# EAGLE design v3leg (EAGLE 7.7.0)

## Sheet 1 of 5
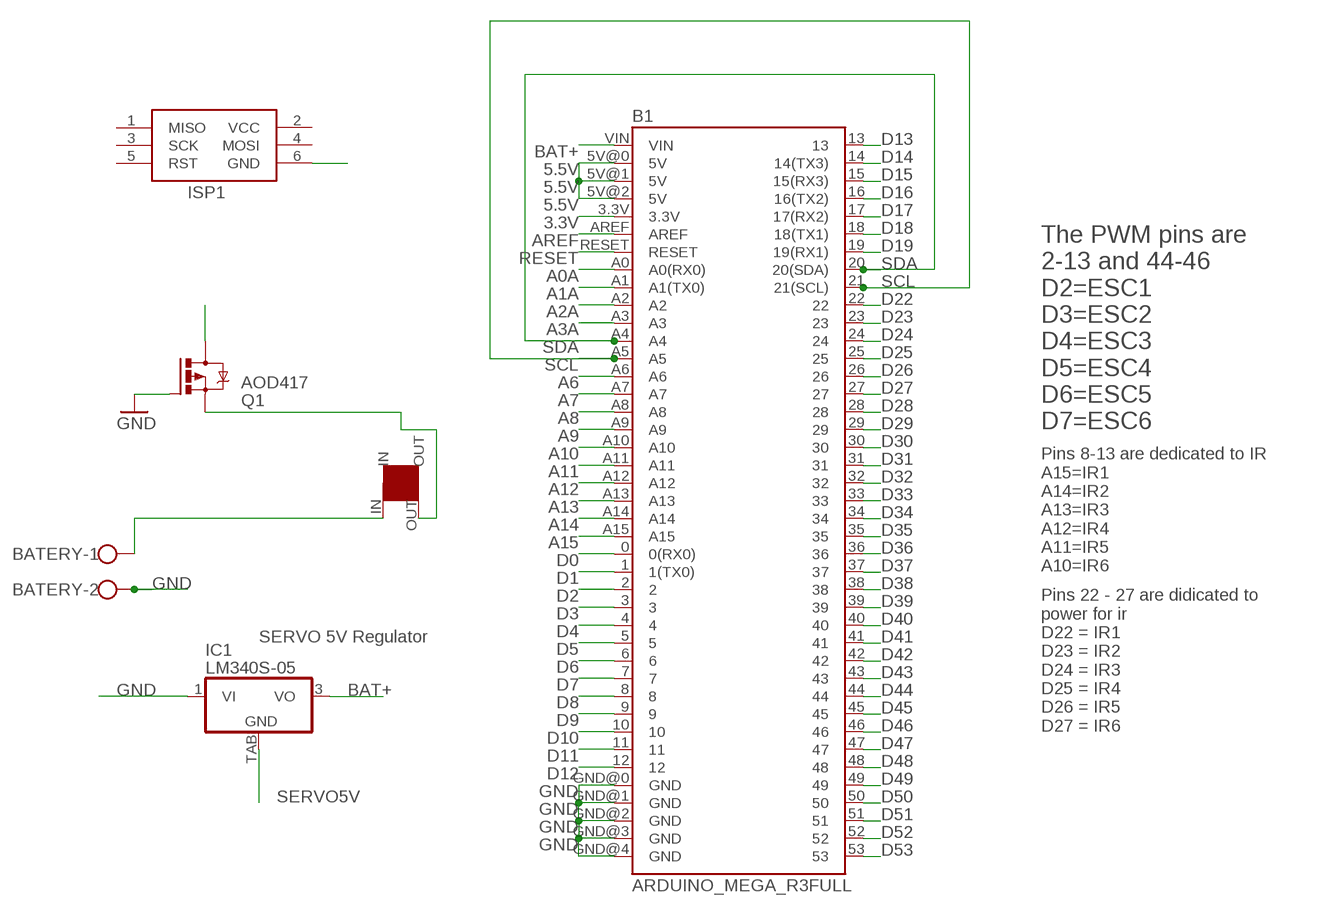
[diagram p0: schematic, sheet 1]

### Parts
B1  ARDUINO_MEGA_R3FULL  [ARDUINO_MEGA]
BATERY  W237-102  [W237-102]
IC1  LM340S-05  [TO263-3]
ISP1  AVRISP-6  [AVRISP]
Q1  AOD417  IRFR5305  [D-PAK_TO252AA]
U$2  TOGGLESWITCH  [TOGGLESWITCH]

### Nets
3.3V: B1.3.3V ; also sheet 2,5
5.5V: B1.5V@0(5V) B1.5V@1(5V) B1.5V@2(5V) ; also sheet 2,3,4,5
A0A: B1.A0(A0(RX0)) ; also sheet 5
A1A: B1.A1(A1(TX0)) ; also sheet 5
A2A: B1.A2 ; also sheet 5
A3A: B1.A3 ; also sheet 5
A6: B1.A6 ; also sheet 2
A7: B1.A7 ; also sheet 2
A8: B1.A8
A9: B1.A9
A10: B1.A10 ; also sheet 2
A11: B1.A11 ; also sheet 2
A12: B1.A12 ; also sheet 2
A13: B1.A13 ; also sheet 2
A14: B1.A14 ; also sheet 2
A15: B1.A15 ; also sheet 2
AREF: B1.AREF ; also sheet 5
BAT+ [hipower]: B1.VIN IC1.3(VO) Q1.4(D) ; also sheet 2,4,5
D0: B1.0(0(RX0)) ; also sheet 5
D1: B1.1(1(TX0)) ; also sheet 5
D2: B1.2 ; also sheet 4,5
D3: B1.3 ; also sheet 4,5
D4: B1.4 ; also sheet 4,5
D5: B1.5 ; also sheet 4,5
D6: B1.6 ; also sheet 4,5
D7: B1.7 ; also sheet 4,5
D8: B1.8 ; also sheet 5
D9: B1.9 ; also sheet 5
D10: B1.10 ; also sheet 5
D11: B1.11 ; also sheet 5
D12: B1.12 ; also sheet 5
D13: B1.13 ; also sheet 5
D14: B1.14(14(TX3))
D15: B1.15(15(RX3))
D16: B1.16(16(TX2))
D17: B1.17(17(RX2))
D18: B1.18(18(TX1))
D19: B1.19(19(RX1))
D22: B1.22
D23: B1.23
D24: B1.24
D25: B1.25
D26: B1.26
D27: B1.27
D28: B1.28
D29: B1.29
D30: B1.30
D31: B1.31
D32: B1.32
D33: B1.33
D34: B1.34
D35: B1.35
D36: B1.36
D37: B1.37
D38: B1.38
D39: B1.39
D40: B1.40
D41: B1.41
D42: B1.42
D43: B1.43
D44: B1.44
D45: B1.45
D46: B1.46
D47: B1.47
D48: B1.48
D49: B1.49
D50: B1.50
D51: B1.51
D52: B1.52
D53: B1.53
GND: B1.GND@0(GND) B1.GND@1(GND) B1.GND@2(GND) B1.GND@3(GND) B1.GND@4(GND) BATERY.2 IC1.1(VI) ISP1.6(GND) Q1.1(G) ; also sheet 2,3,4,5
N$4 [hipower]: BATERY.1 U$2.IN
N$5 [hipower]: Q1.3(S) U$2.OUT
RESET: B1.RESET ; also sheet 5
SCL: B1.21(21(SCL)) B1.A5 ; also sheet 2,3,5
SDA: B1.20(20(SDA)) B1.A4 ; also sheet 2,3,5
SERVO5V [lopower]: IC1.TAB(GND) ; also sheet 5
Unconnected: ISP1.1(MISO) ISP1.3(SCK) ISP1.4(MOSI) ISP1.5(RST)

### Notes on the sheet
- The PWM pins are
  2-13 and 44-46
  D2=ESC1
  D3=ESC2
  D4=ESC3
  D5=ESC4
  D6=ESC5
  D7=ESC6
- Pins 8-13 are dedicated to IR
  A15=IR1
  A14=IR2
  A13=IR3
  A12=IR4
  A11=IR5
  A10=IR6
- SERVO 5V Regulator
- Pins 22 - 27 are didicated to
  power for ir
  D22 = IR1
  D23 = IR2
  D24 = IR3
  D25 = IR4
  D26 = IR5
  D27 = IR6

## Sheet 2 of 5
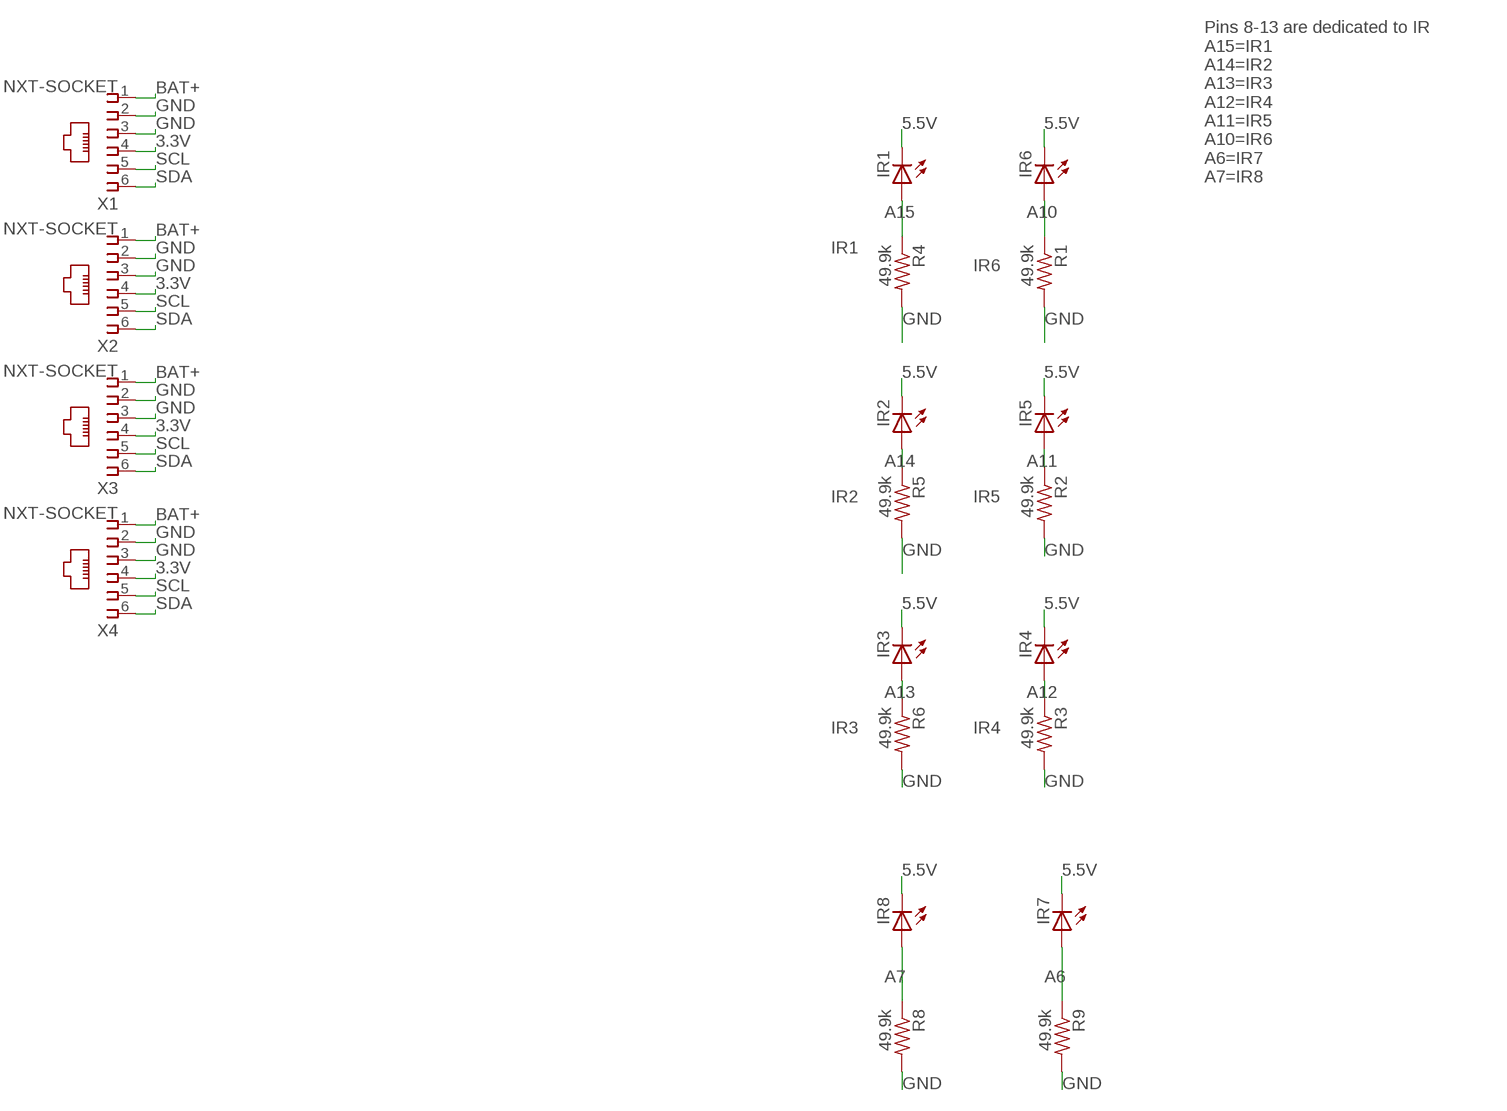
[diagram p1: schematic, sheet 2]

### Parts
IR1  LED5MM  [LED5MM]
IR2  LED5MM  [LED5MM]
IR3  LED5MM  [LED5MM]
IR4  LED5MM  [LED5MM]
IR5  LED5MM  [LED5MM]
IR6  LED5MM  [LED5MM]
IR7  LED5MM  [LED5MM]
IR8  LED5MM  [LED5MM]
R1  49.9k  R-US_R0603  [R0603]
R2  49.9k  R-US_R0603  [R0603]
R3  49.9k  R-US_R0603  [R0603]
R4  49.9k  R-US_R0603  [R0603]
R5  49.9k  R-US_R0603  [R0603]
R6  49.9k  R-US_R0603  [R0603]
R8  49.9k  R-US_R0603  [R0603]
R9  49.9k  R-US_R0603  [R0603]
X1  NXT-SOCKET  [NXT-SOCKET]
X2  NXT-SOCKET  [NXT-SOCKET]
X3  NXT-SOCKET  [NXT-SOCKET]
X4  NXT-SOCKET  [NXT-SOCKET]

### Nets
3.3V: X1.4 X2.4 X3.4 X4.4 ; also sheet 1,5
5.5V: IR1.K(C) IR2.K(C) IR3.K(C) IR4.K(C) IR5.K(C) IR6.K(C) IR7.K(C) IR8.K(C) ; also sheet 1,3,4,5
A6: IR7.A R9.1 ; also sheet 1
A7: IR8.A R8.1 ; also sheet 1
A10: IR6.A R1.1 ; also sheet 1
A11: IR5.A R2.1 ; also sheet 1
A12: IR4.A R3.1 ; also sheet 1
A13: IR3.A R6.1 ; also sheet 1
A14: IR2.A R5.1 ; also sheet 1
A15: IR1.A R4.1 ; also sheet 1
BAT+ [hipower]: X1.1 X2.1 X3.1 X4.1 ; also sheet 1,4,5
GND: R1.2 R2.2 R3.2 R4.2 R5.2 R6.2 R8.2 R9.2 X1.2 X1.3 X2.2 X2.3 X3.2 X3.3 X4.2 X4.3 ; also sheet 1,3,4,5
SCL: X1.5 X2.5 X3.5 X4.5 ; also sheet 1,3,5
SDA: X1.6 X2.6 X3.6 X4.6 ; also sheet 1,3,5

### Notes on the sheet
- Pins 8-13 are dedicated to IR
  A15=IR1
  A14=IR2
  A13=IR3
  A12=IR4
  A11=IR5
  A10=IR6
  A6=IR7
  A7=IR8
- IR1
- IR6
- IR2 | IR5
- IR3 | IR4

## Sheet 3 of 5
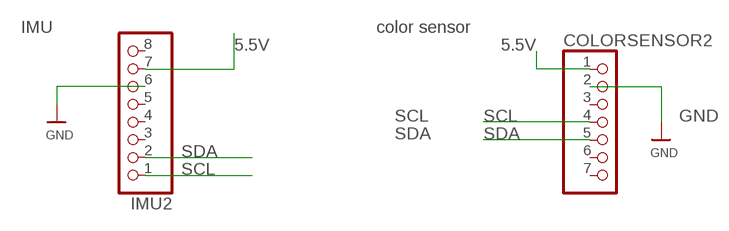
[diagram p2: schematic, sheet 3]

### Parts
COLORSENSOR2  HEADER-1X770MIL  [1X07_ROUND_70]
IMU2  HEADER-1X876MIL  [1X08_ROUND_76]

### Nets
5.5V: COLORSENSOR2.1 IMU2.7 ; also sheet 1,2,4,5
GND: COLORSENSOR2.2 IMU2.6 ; also sheet 1,2,4,5
SCL: COLORSENSOR2.4 IMU2.1 ; also sheet 1,2,5
SDA: COLORSENSOR2.5 IMU2.2 ; also sheet 1,2,5
Unconnected: COLORSENSOR2.3 COLORSENSOR2.6 COLORSENSOR2.7 IMU2.3 IMU2.4 IMU2.5 IMU2.8

### Notes on the sheet
- IMU | color sensor

## Sheet 4 of 5
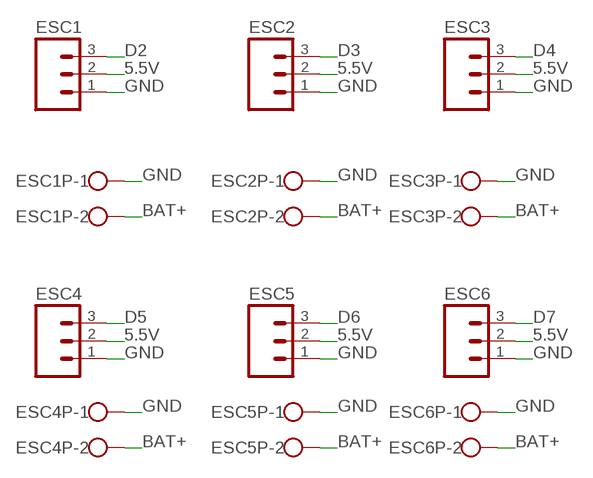
[diagram p3: schematic, sheet 4]

### Parts
ESC1  M03LOCK  [1X03_LOCK]
ESC1P  W237-102  [W237-102]
ESC2  M03LOCK  [1X03_LOCK]
ESC2P  W237-102  [W237-102]
ESC3  M03LOCK  [1X03_LOCK]
ESC3P  W237-102  [W237-102]
ESC4  M03LOCK  [1X03_LOCK]
ESC4P  W237-102  [W237-102]
ESC5  M03LOCK  [1X03_LOCK]
ESC5P  W237-102  [W237-102]
ESC6  M03LOCK  [1X03_LOCK]
ESC6P  W237-102  [W237-102]

### Nets
5.5V: ESC1.2 ESC2.2 ESC3.2 ESC4.2 ESC5.2 ESC6.2 ; also sheet 1,2,3,5
BAT+ [hipower]: ESC1P.2 ESC2P.2 ESC3P.2 ESC4P.2 ESC5P.2 ESC6P.2 ; also sheet 1,2,5
D2: ESC1.3 ; also sheet 1,5
D3: ESC2.3 ; also sheet 1,5
D4: ESC3.3 ; also sheet 1,5
D5: ESC4.3 ; also sheet 1,5
D6: ESC5.3 ; also sheet 1,5
D7: ESC6.3 ; also sheet 1,5
GND: ESC1.1 ESC1P.1 ESC2.1 ESC2P.1 ESC3.1 ESC3P.1 ESC4.1 ESC4P.1 ESC5.1 ESC5P.1 ESC6.1 ESC6P.1 ; also sheet 1,2,3,5

## Sheet 5 of 5
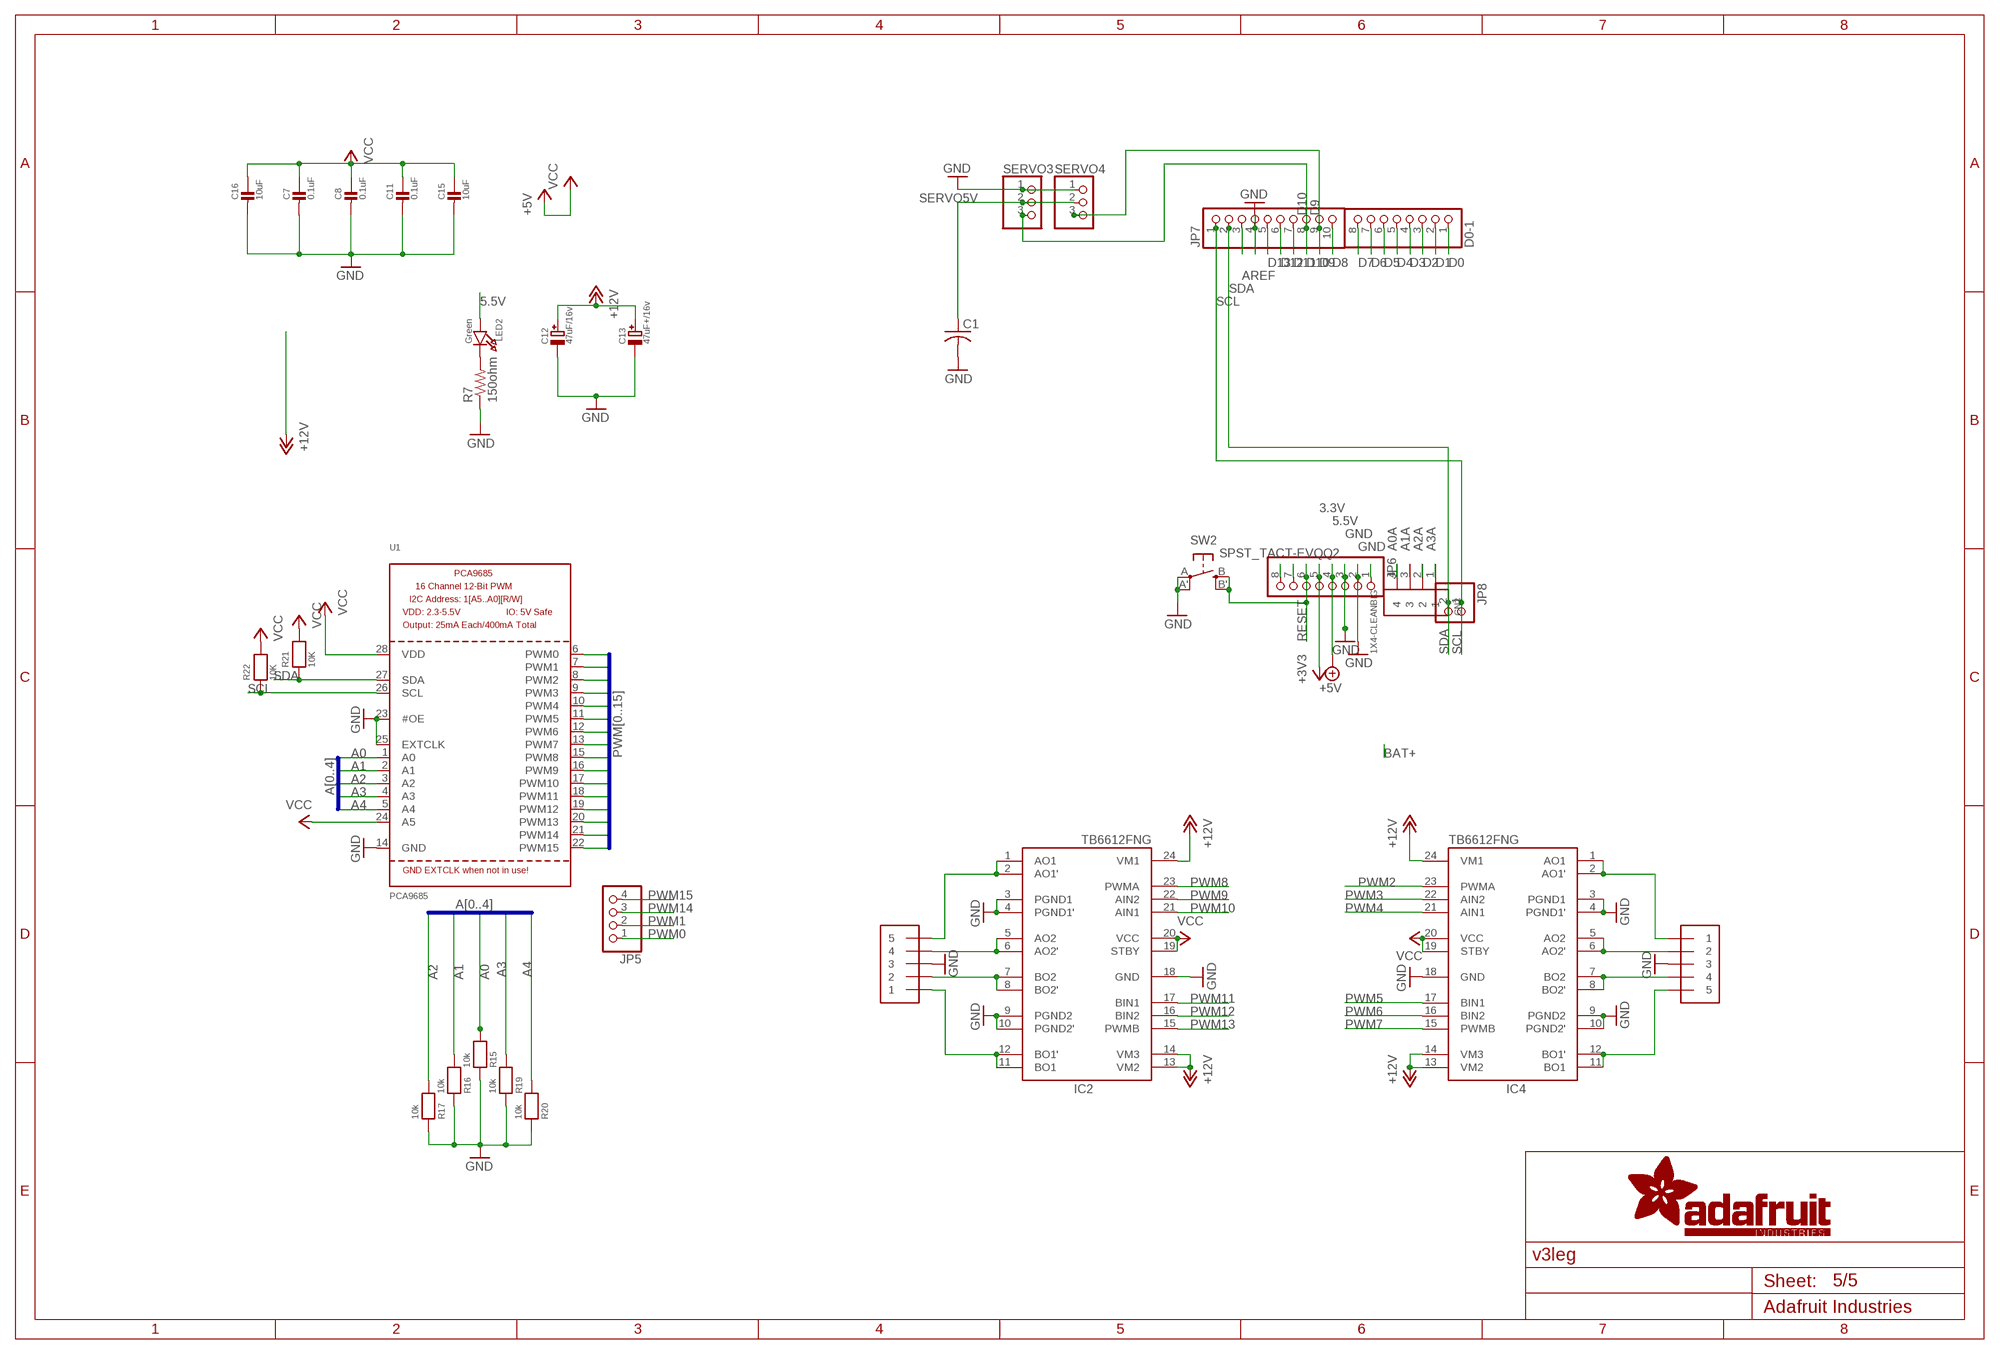
[diagram p4: schematic, sheet 5]

### Parts
C1  C-USC0805  [C0805]
C7  0.1uF  CAP_CERAMIC0805-NOOUTLINE  [0805-NO]
C8  0.1uF  CAP_CERAMIC0805-NOOUTLINE  [0805-NO]
C11  0.1uF  CAP_CERAMIC0805-NOOUTLINE  [0805-NO]
C12  47uF/16v  CAP_ELECTROLYTICPANASONIC_C  [PANASONIC_C]
C13  47uF+/16v  CAP_ELECTROLYTICPANASONIC_C  [PANASONIC_C]
C15  10uF  CAP_CERAMIC0805-NOOUTLINE  [0805-NO]
C16  10uF  CAP_CERAMIC0805-NOOUTLINE  [0805-NO]
CN2  1X4-CLEANBIG  [1X04-CLEANBIG]
D0-1  PINHD-1X8CLEANBIG  [1X08-CLEANBIG]
IC2  TB6612FNG  [SSOP24]
IC4  TB6612FNG  [SSOP24]
J3  1X5  [1X05-3.5MM]
J4  1X5  [1X05-3.5MM]
JP5  HEADER-1X476MIL  [1X04_ROUND_76]
JP6  PINHD-1X8CLEANBIG  [1X08-CLEANBIG]
JP7  HEADER-1X1070MIL  [1X10_ROUND70]
JP8  HEADER-1X2ROUND  [1X02_ROUND]
LED2  Green  LED0805_NOOUTLINE  [CHIPLED_0805_NOOUTLINE]
R7  150ohm  R-US_R0603  [R0603]
R15  10k  RESISTOR0805_NOOUTLINE  [0805-NO]
R16  10k  RESISTOR0805_NOOUTLINE  [0805-NO]
R17  10k  RESISTOR0805_NOOUTLINE  [0805-NO]
R19  10k  RESISTOR0805_NOOUTLINE  [0805-NO]
R20  10k  RESISTOR0805_NOOUTLINE  [0805-NO]
R21  10K  RESISTOR0805_NOOUTLINE  [0805-NO]
R22  10K  RESISTOR0805_NOOUTLINE  [0805-NO]
SERVO3  PINHD-1X3  [1X03]
SERVO4  PINHD-1X3  [1X03]
SW2  SPST_TACT-EVQQ2  [EVQ-Q2]
U1  PCA9685  [TSSOP28]

### Nets
3.3V: JP6.5 ; supply symbol labelled +3V3 ; also sheet 1,2
5.5V: C7.1 C8.1 C11.1 C15.1 C16.1 IC2.19(STBY) IC2.20(VCC) IC4.19(STBY) IC4.20(VCC) JP6.4 LED2.A R21.2 R22.2 U1.24(A5) U1.28(VDD) ; supply symbol labelled +5V, VCC ; also sheet 1,2,3,4
A0 [signal]: R15.2 U1.1(A0)
A0A: CN2.4 ; also sheet 1
A1 [signal]: R16.2 U1.2(A1)
A1A: CN2.3 ; also sheet 1
A2 [signal]: R17.2 U1.3(A2)
A2A: CN2.2 ; also sheet 1
A3 [signal]: R19.2 U1.4(A3)
A3A: CN2.1 ; also sheet 1
A4 [signal]: R20.2 U1.5(A4)
AREF: JP7.3 ; also sheet 1
BAT+ [hipower]: C12.+ C13.+ IC2.13(VM2) IC2.14(VM3) IC2.24(VM1) IC4.13(VM2) IC4.14(VM3) IC4.24(VM1) JP6.1 ; supply symbol labelled +12V ; also sheet 1,2,4
D0: D0-1.1 ; also sheet 1
D1: D0-1.2 ; also sheet 1
D2: D0-1.3 ; also sheet 1,4
D3: D0-1.4 ; also sheet 1,4
D4: D0-1.5 ; also sheet 1,4
D5: D0-1.6 ; also sheet 1,4
D6: D0-1.7 ; also sheet 1,4
D7: D0-1.8 ; also sheet 1,4
D8: JP7.10 ; also sheet 1
D9: JP7.9 SERVO4.3 ; also sheet 1
D10: JP7.8 SERVO3.3 ; also sheet 1
D11: JP7.7 ; also sheet 1
D12: JP7.6 ; also sheet 1
D13: JP7.5 ; also sheet 1
GND: C1.2 C7.2 C8.2 C11.2 C12.- C13.- C15.2 C16.2 IC2.3(PGND1) IC2.4(PGND1') IC2.9(PGND2) IC2.10(PGND2') IC2.18(GND) IC4.3(PGND1) IC4.4(PGND1') IC4.9(PGND2) IC4.10(PGND2') IC4.18(GND) J3.3 J4.3 JP6.2 JP6.3 JP7.4 R7.1 R15.1 R16.1 R17.1 R19.1 R20.1 SERVO3.1 SERVO4.1 SW2.A'(P1) SW2.A(P) U1.14(GND) U1.23(#OE) U1.25(EXTCLK) ; also sheet 1,2,3,4
IOREF1: JP6.7
M1A1 [lopower]: IC2.1(AO1) IC2.2(AO1') J3.5
M1B1 [lopower]: IC2.5(AO2) IC2.6(AO2') J3.4
M2A1 [lopower]: IC2.11(BO1) IC2.12(BO1') J3.1
M2B1 [lopower]: IC2.7(BO2) IC2.8(BO2') J3.2
M3A1 [lopower]: IC4.1(AO1) IC4.2(AO1') J4.1
M3B1 [lopower]: IC4.5(AO2) IC4.6(AO2') J4.2
M4A1 [lopower]: IC4.11(BO1) IC4.12(BO1') J4.5
M4B1 [lopower]: IC4.7(BO2) IC4.8(BO2') J4.4
N$1: LED2.C R7.2
N$3: JP6.8
PWM0 [signal]: JP5.1 U1.6(PWM0)
PWM1 [signal]: JP5.2 U1.7(PWM1)
PWM2 [signal]: IC4.23(PWMA) U1.8(PWM2)
PWM3 [signal]: IC4.22(AIN2) U1.9(PWM3)
PWM4 [signal]: IC4.21(AIN1) U1.10(PWM4)
PWM5 [signal]: IC4.17(BIN1) U1.11(PWM5)
PWM6 [signal]: IC4.16(BIN2) U1.12(PWM6)
PWM7 [signal]: IC4.15(PWMB) U1.13(PWM7)
PWM8 [signal]: IC2.23(PWMA) U1.15(PWM8)
PWM9 [signal]: IC2.22(AIN2) U1.16(PWM9)
PWM10 [signal]: IC2.21(AIN1) U1.17(PWM10)
PWM11 [signal]: IC2.17(BIN1) U1.18(PWM11)
PWM12 [signal]: IC2.16(BIN2) U1.19(PWM12)
PWM13 [signal]: IC2.15(PWMB) U1.20(PWM13)
PWM14 [signal]: JP5.3 U1.21(PWM14)
PWM15 [signal]: JP5.4 U1.22(PWM15)
RESET: JP6.6 SW2.B'(S1) SW2.B(S) ; also sheet 1
SCL: JP7.1 JP8.1 R22.1 U1.26(SCL) ; also sheet 1,2,3
SDA: JP7.2 JP8.2 R21.1 U1.27(SDA) ; also sheet 1,2,3
SERVO5V [lopower]: C1.1 SERVO3.2 SERVO4.2 ; also sheet 1

### Buses
PWM[0..15]
A[0..4]

## Power pins joined to a net without a drawn wire
5.5V: ISP1.2(VCC)

## Library data of the parts
B1 = SparkFun-Boards:ARDUINO_MEGA_R3: Arduino Mega R3 ATmega2560 R3 compatible footprint. SparkFun Products: Arduino Mega 2560 R3 <https://www.sparkfun.com/products/11061>; OC_NEWARK: unknown
BATERY ESC1P ESC2P ESC3P ESC4P ESC5P ESC6P = con-wago-500:W237-102: WAGO SCREW CLAMP; MPN: MA522-500M02; OC_FARNELL: unknown; OC_NEWARK: 04R6830
C1 = rcl:C-US: CAPACITOR, American symbol
C7 C8 C11 = microbuilder:CAP_CERAMIC: Ceramic Capacitors For new designs, use the packages preceded by an '_' character since they are more reliable: The following footprints should be used on most boards: _0402 - Standard footprint for regular board layouts _0603 - Standard footprint for regular board layouts _0805 - Standard footprint for regular board layouts For extremely tight-pitch boards where space is at a premium, the following 'micro-pitch' footprints can be used (smaller pads, no silkscreen outline, etc.): _0402MP - Micro-pitch footprint for very dense/compact boards _0603MP - Micro-pitch footprint for very dense/compact boards _0805MP - Micro-pitch footprint for very dense/compact boards Commonly Stocked Parts 0402 - 0402 Surface Mount Capacitors 16pF 50V 5% [Digikey: 445-4899-2-ND] 18pF 50V 5% [Digikey: 490-1281-2-ND] 22pF 50V 5% [Digikey: 490-1283-2-ND] 68pF 50V 5% [Digikey: 490-1289-2-ND] 0.1uF 10V 10% [Digikey: 490-1318-2-ND] 1.0uF 6.3V 10% [Digikey: 490-1320-2-ND] 0603 - 0603 Surface Mount Capacitors 16 pF 50V 5% [Digikey: 445-5051-2-ND] 22 pF 50V [Digikey: PCC220ACVTR-ND] 33 pF 50V 5% [Digikey: 490-1415-1-ND] 56pF 50V 5% [Digikey: 490-1421-1-ND] 220pF 50V 5% [Digikey: 445-1285-1-ND] 680 pF 50V 2200 pF 50V 5% C0G [Digikey: 445-1297-1-ND] 5600 pF 100V 5% X7R [Digikey: 478-3711-1-ND] 0.1 µF 25V 10% [Digikey: PCC2277TR-ND] 0.22 µF 16V 10% X7R [Digikey: 445-1318-1-ND] 1.0 µF 25V 10% [Digikey: 445-5146-2-ND] 0603 - RF Specific 3pF 250V +/-0.1pF RF [Digikey: 712-1347-1-ND] 18 pF 250V 5% [Digikey: 478-3505-1-ND or 712-1322-1-ND] 56 pF 250V 5% C0G RF [Digikey: 490-4867-1-ND] 68 pF 250V RF [Digikey: 490-4868-1-ND] 0805 - 0805 Surface Mount Capacitors 220 pF 250V 2% RF Ceramic Capacitor [Digikey: 712-1398-1-ND] 1000 pF 50V 2% NP0 Ceramic Capacitor [Digikey: 478-3760-1-ND] 0.1 µF 25V 10% Ceramic Capacitor [Digikey: PCC1828TR-ND] 1.0 µF 16V 10% Ceramic Capacitor[Digikey: 490-1691-2-ND] 10.0 µF 10V 10% Ceramic Capacitor[Digikey: 709-1228-1-ND] 10.0 uF 16V 10% Ceramic Capacitor [Digikey: 478-5165-2-ND] 47 uF 6.3V 20% Ceramic Capacitor [Digikey: 587-1779-1-ND or 399-5506-1-ND] 1206 - 1206 Surface Mount Capacitors 47uF 10V 20% Ceramic Capacitor [Digikey: 490-5528-1-ND or 399-5508-1-ND or 445-6010-1-ND] 100uF 6.3V -20%, +80% Y5V Ceramic Capacitor (Digikey: 490-4512-1-ND, Mouser: 81-GRM31CF50J107ZE1L); MPN: 0603YC104K4Z2A; OC_NEWARK: 26M5119
C12 C13 = microbuilder:CAP_ELECTROLYTIC: Electrolytic Capacitors SMT PANASONIC_C - Size C Panasonic Electrolytic Aluminum Capacitor 47µF 16V 20% Electrolytic Capacitor [Digikey: PCE3890TR-ND] PANASONIC_D - Size D Panasonic Electrolytic Aluminum Capacitor 100µF 25V 20% Electrolytic Capacitor [Digikey: PCE3898TR-ND] PTH 3.5 mm grid, 8 mm diameter ... 3.5 mm grid, 10 mm diameter ...; MPN: EEEHB1C470P; OC_NEWARK: 17AC6791
C15 C16 = microbuilder:CAP_CERAMIC: Ceramic Capacitors For new designs, use the packages preceded by an '_' character since they are more reliable: The following footprints should be used on most boards: _0402 - Standard footprint for regular board layouts _0603 - Standard footprint for regular board layouts _0805 - Standard footprint for regular board layouts For extremely tight-pitch boards where space is at a premium, the following 'micro-pitch' footprints can be used (smaller pads, no silkscreen outline, etc.): _0402MP - Micro-pitch footprint for very dense/compact boards _0603MP - Micro-pitch footprint for very dense/compact boards _0805MP - Micro-pitch footprint for very dense/compact boards Commonly Stocked Parts 0402 - 0402 Surface Mount Capacitors 16pF 50V 5% [Digikey: 445-4899-2-ND] 18pF 50V 5% [Digikey: 490-1281-2-ND] 22pF 50V 5% [Digikey: 490-1283-2-ND] 68pF 50V 5% [Digikey: 490-1289-2-ND] 0.1uF 10V 10% [Digikey: 490-1318-2-ND] 1.0uF 6.3V 10% [Digikey: 490-1320-2-ND] 0603 - 0603 Surface Mount Capacitors 16 pF 50V 5% [Digikey: 445-5051-2-ND] 22 pF 50V [Digikey: PCC220ACVTR-ND] 33 pF 50V 5% [Digikey: 490-1415-1-ND] 56pF 50V 5% [Digikey: 490-1421-1-ND] 220pF 50V 5% [Digikey: 445-1285-1-ND] 680 pF 50V 2200 pF 50V 5% C0G [Digikey: 445-1297-1-ND] 5600 pF 100V 5% X7R [Digikey: 478-3711-1-ND] 0.1 µF 25V 10% [Digikey: PCC2277TR-ND] 0.22 µF 16V 10% X7R [Digikey: 445-1318-1-ND] 1.0 µF 25V 10% [Digikey: 445-5146-2-ND] 0603 - RF Specific 3pF 250V +/-0.1pF RF [Digikey: 712-1347-1-ND] 18 pF 250V 5% [Digikey: 478-3505-1-ND or 712-1322-1-ND] 56 pF 250V 5% C0G RF [Digikey: 490-4867-1-ND] 68 pF 250V RF [Digikey: 490-4868-1-ND] 0805 - 0805 Surface Mount Capacitors 220 pF 250V 2% RF Ceramic Capacitor [Digikey: 712-1398-1-ND] 1000 pF 50V 2% NP0 Ceramic Capacitor [Digikey: 478-3760-1-ND] 0.1 µF 25V 10% Ceramic Capacitor [Digikey: PCC1828TR-ND] 1.0 µF 16V 10% Ceramic Capacitor[Digikey: 490-1691-2-ND] 10.0 µF 10V 10% Ceramic Capacitor[Digikey: 709-1228-1-ND] 10.0 uF 16V 10% Ceramic Capacitor [Digikey: 478-5165-2-ND] 47 uF 6.3V 20% Ceramic Capacitor [Digikey: 587-1779-1-ND or 399-5506-1-ND] 1206 - 1206 Surface Mount Capacitors 47uF 10V 20% Ceramic Capacitor [Digikey: 490-5528-1-ND or 399-5508-1-ND or 445-6010-1-ND] 100uF 6.3V -20%, +80% Y5V Ceramic Capacitor (Digikey: 490-4512-1-ND, Mouser: 81-GRM31CF50J107ZE1L); MPN: GRM21BC80J106KE19L; OC_NEWARK: 03AC2709
CN2 = adafruit@1:1X4: 4-pin connector; OC_NEWARK: unknown
COLORSENSOR2 = microbuilder:HEADER-1X7: PIN HEADER; OC_NEWARK: unknown
D0-1 JP6 = adafruit@1:PINHD-1X8: PIN HEADER; OC_NEWARK: unknown
ESC1-ESC6 = SparkFun:M03: Header 3 Standard 3-pin 0.1" header. Use with straight break away headers (SKU : PRT-00116), right angle break away headers (PRT-00553), swiss pins (PRT-00743), machine pins (PRT-00117), and female headers (PRT-00115). Molex polarized connector foot print use with SKU : PRT-08232 with associated crimp pins and housings.; MF: MOLEX; MPN: 22-11-2032; OC_NEWARK: 81C8218
IC1 = linear:LM340?-*: Positive VOLTAGE REGULATOR Source: http://cache.national.com/ds/LM/LM340.pdf; MPN: LM1085ISX-5.0/NOPB; OC_NEWARK: 01AC5221
IC2 IC4 = adafruit@1:TB6612FNG: TB6612FNG MOS dual H-bridge motor driver, 1.2A current 3.2A peak 3 or 5v logic and 3-15v motor; OC_NEWARK: unknown
IMU2 = microbuilder:HEADER-1X8: PIN HEADER; OC_NEWARK: unknown
IR1-IR8 = led:LED: LED; MPN: OP993; OC_NEWARK: 42AC0040
ISP1 = adafruit:AVRISP: AVR ISP HEADER Standard 6 pin header for AVR programming; OC_NEWARK: unknown
J3 J4 = adafruit@1:1X5; OC_NEWARK: unknown
JP5 = microbuilder:HEADER-1X4: PIN HEADER; OC_NEWARK: unknown
JP7 = microbuilder:HEADER-1X10: PIN HEADER; OC_NEWARK: unknown
JP8 = microbuilder:HEADER-1X2: PIN HEADER; OC_NEWARK: unknown
LED2 = microbuilder:LED: LED; MPN: MCL-S270GC; OC_NEWARK: 14N9356
Q1 = transistor-power:IRF?5305: HEXFET Power MOSFET Source: http://www.irf.com/product-info/datasheets/data/irfr5305pbf.pdf; MPN: AUIRFR540ZTRL; OC_NEWARK: 91Y4154
R1-R6 R8 R9 = adafruit:R-US_: RESISTOR, American symbol; MPN: CR0603-JW-103GLF; OC_NEWARK: 12AC0507
R7 = rcl:R-US_: RESISTOR, American symbol; OC_NEWARK: unknown
R15-R17 R19-R22 = microbuilder:RESISTOR: Resistors For new designs, use the packages preceded by an '_' character since they are more reliable: The following footprints should be used on most boards: _0402 - Standard footprint for regular board layouts _0603 - Standard footprint for regular board layouts _0805 - Standard footprint for regular board layouts For extremely tight-pitch boards where space is at a premium, the following 'micro-pitch' footprints can be used (smaller pads, no silkscreen outline, etc.): _0402MP - Micro-pitch footprint for very dense/compact boards _0603MP - Micro-pitch footprint for very dense/compact boards _0805MP - Micro-pitch footprint for very dense/compact boards; MF: VISHAY/DALE; MPN: CRCW080510K0FKTA; OC_NEWARK: 05F1511
SERVO3 SERVO4 = adafruit@1:PINHD-1X3: PIN HEADER; OC_NEWARK: unknown
SW2 = adafruit@1:SPST_TACT: SMT 6mm switch, EVQQ2 series http://www.ladyada.net/library/eagle; MPN: EVQ-Q2P03W; OC_NEWARK: 01X1669
U1 = microbuilder:PCA9685: PCA9685 - 16 Channel 12-Bit I2C PWM Controller 5.0V tolerant 16 channel, 12-bit I2C PWM controller with 25mA per output (max. 400mA total) Digikey: 568-5931-1-ND; MPN: 6EDL04N02PRXUMA1; OC_NEWARK: 18AC0914
U$2 = toggleswitch:TOGGLESWITCH
X1-X4 = NXT Compatible (female) Sockets - Mindsensors:NXT-SOCKET: RJ11 6 connects Manufacturer: Mindsensors.com Source: NXT-Female-Socket.pdf; MPN: RJE01-660-01; OC_FARNELL: unknown; OC_NEWARK: 01M6133

## Net classes
0 default: width 0.508 mm, clearance 0.206 mm
1 hipower: width 1.651 mm, clearance 0.206 mm
2 lopower: width 0.762 mm, clearance 0.206 mm
3 signal: width 0.254 mm, clearance 0.206 mm

## Board
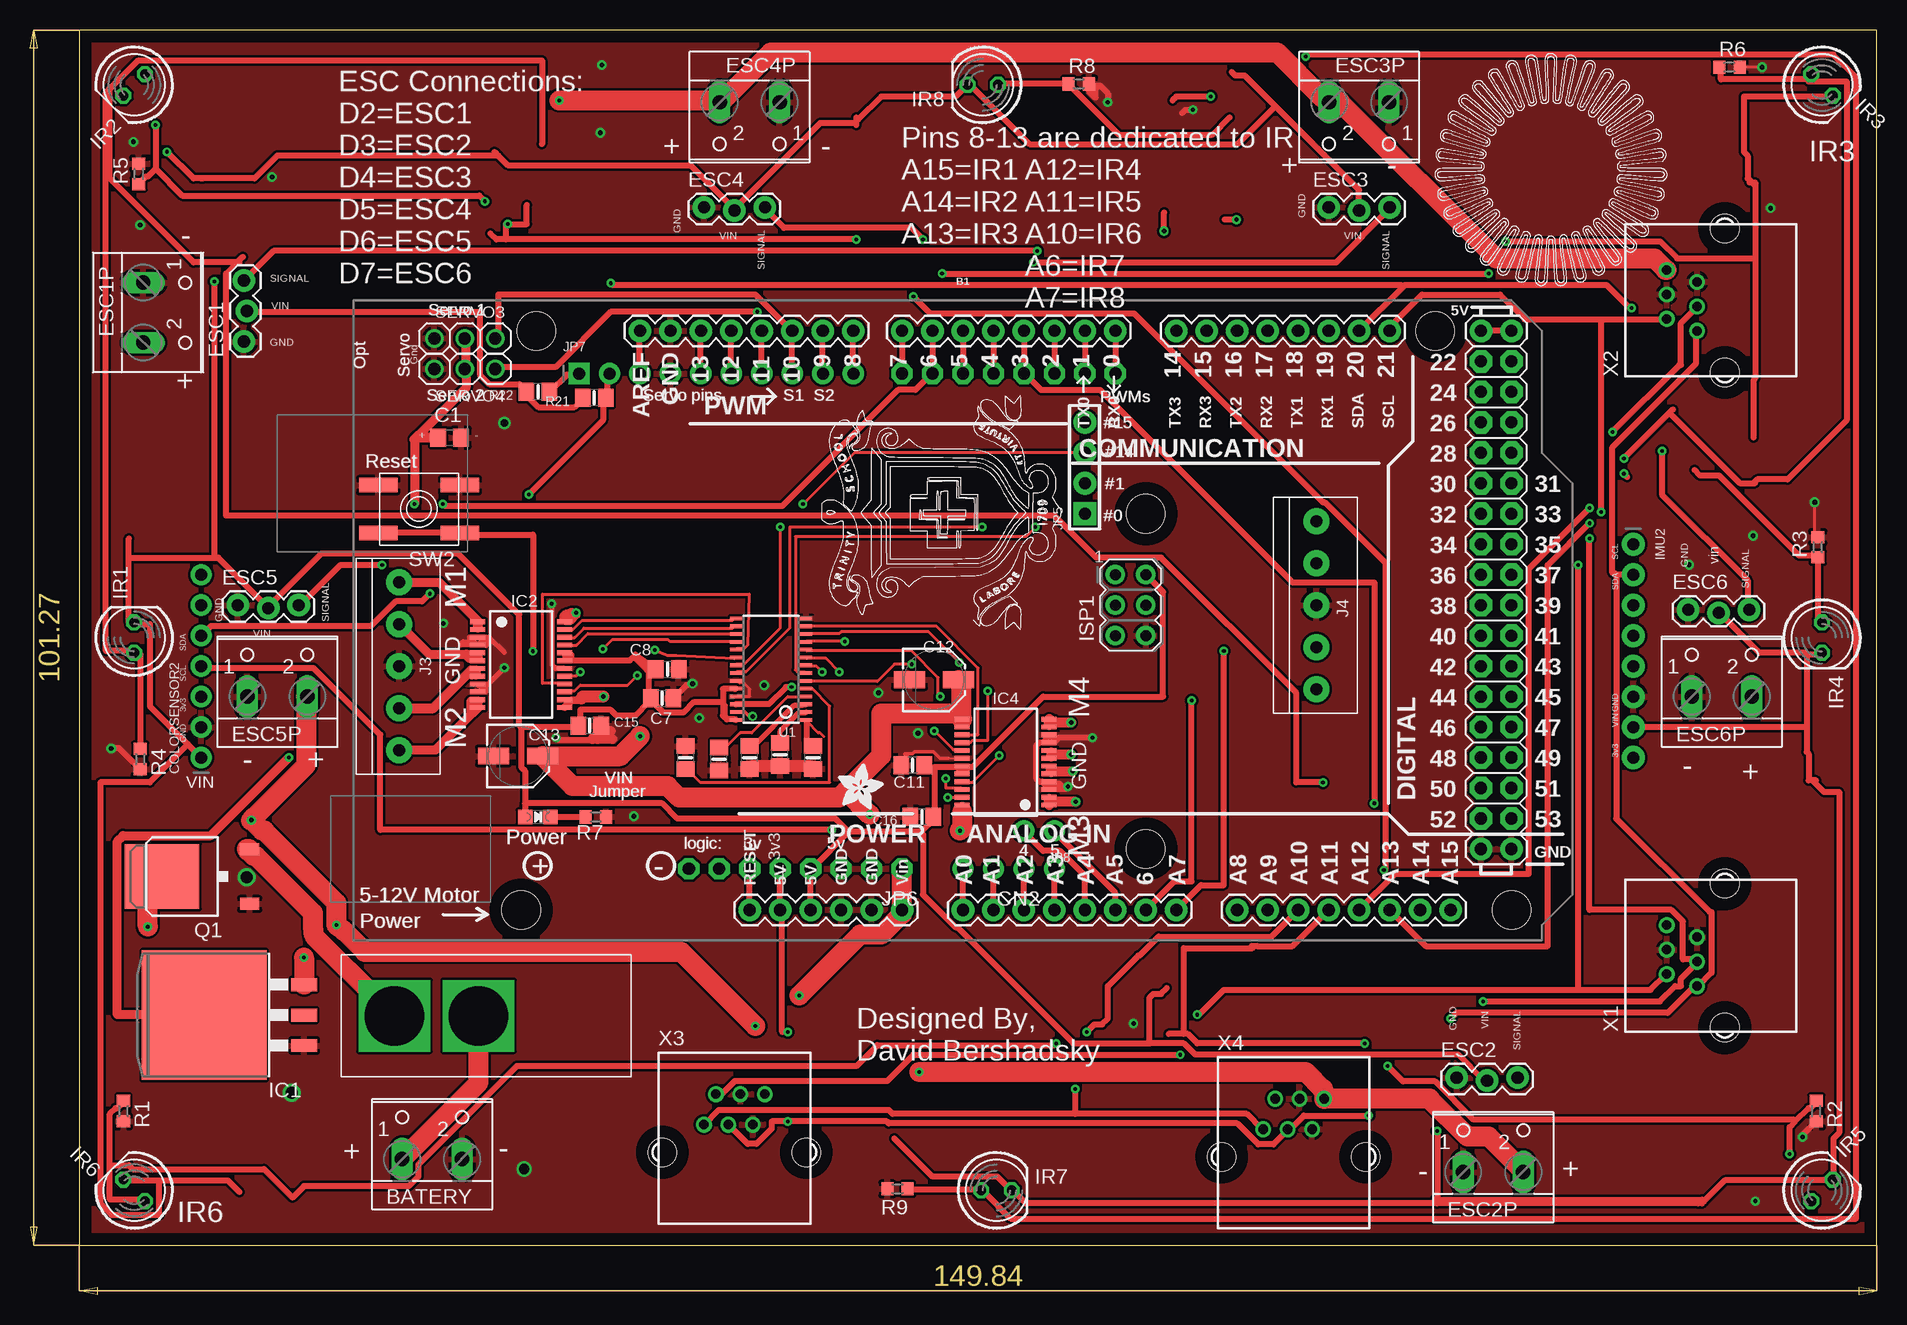
[diagram p5: board, top side]
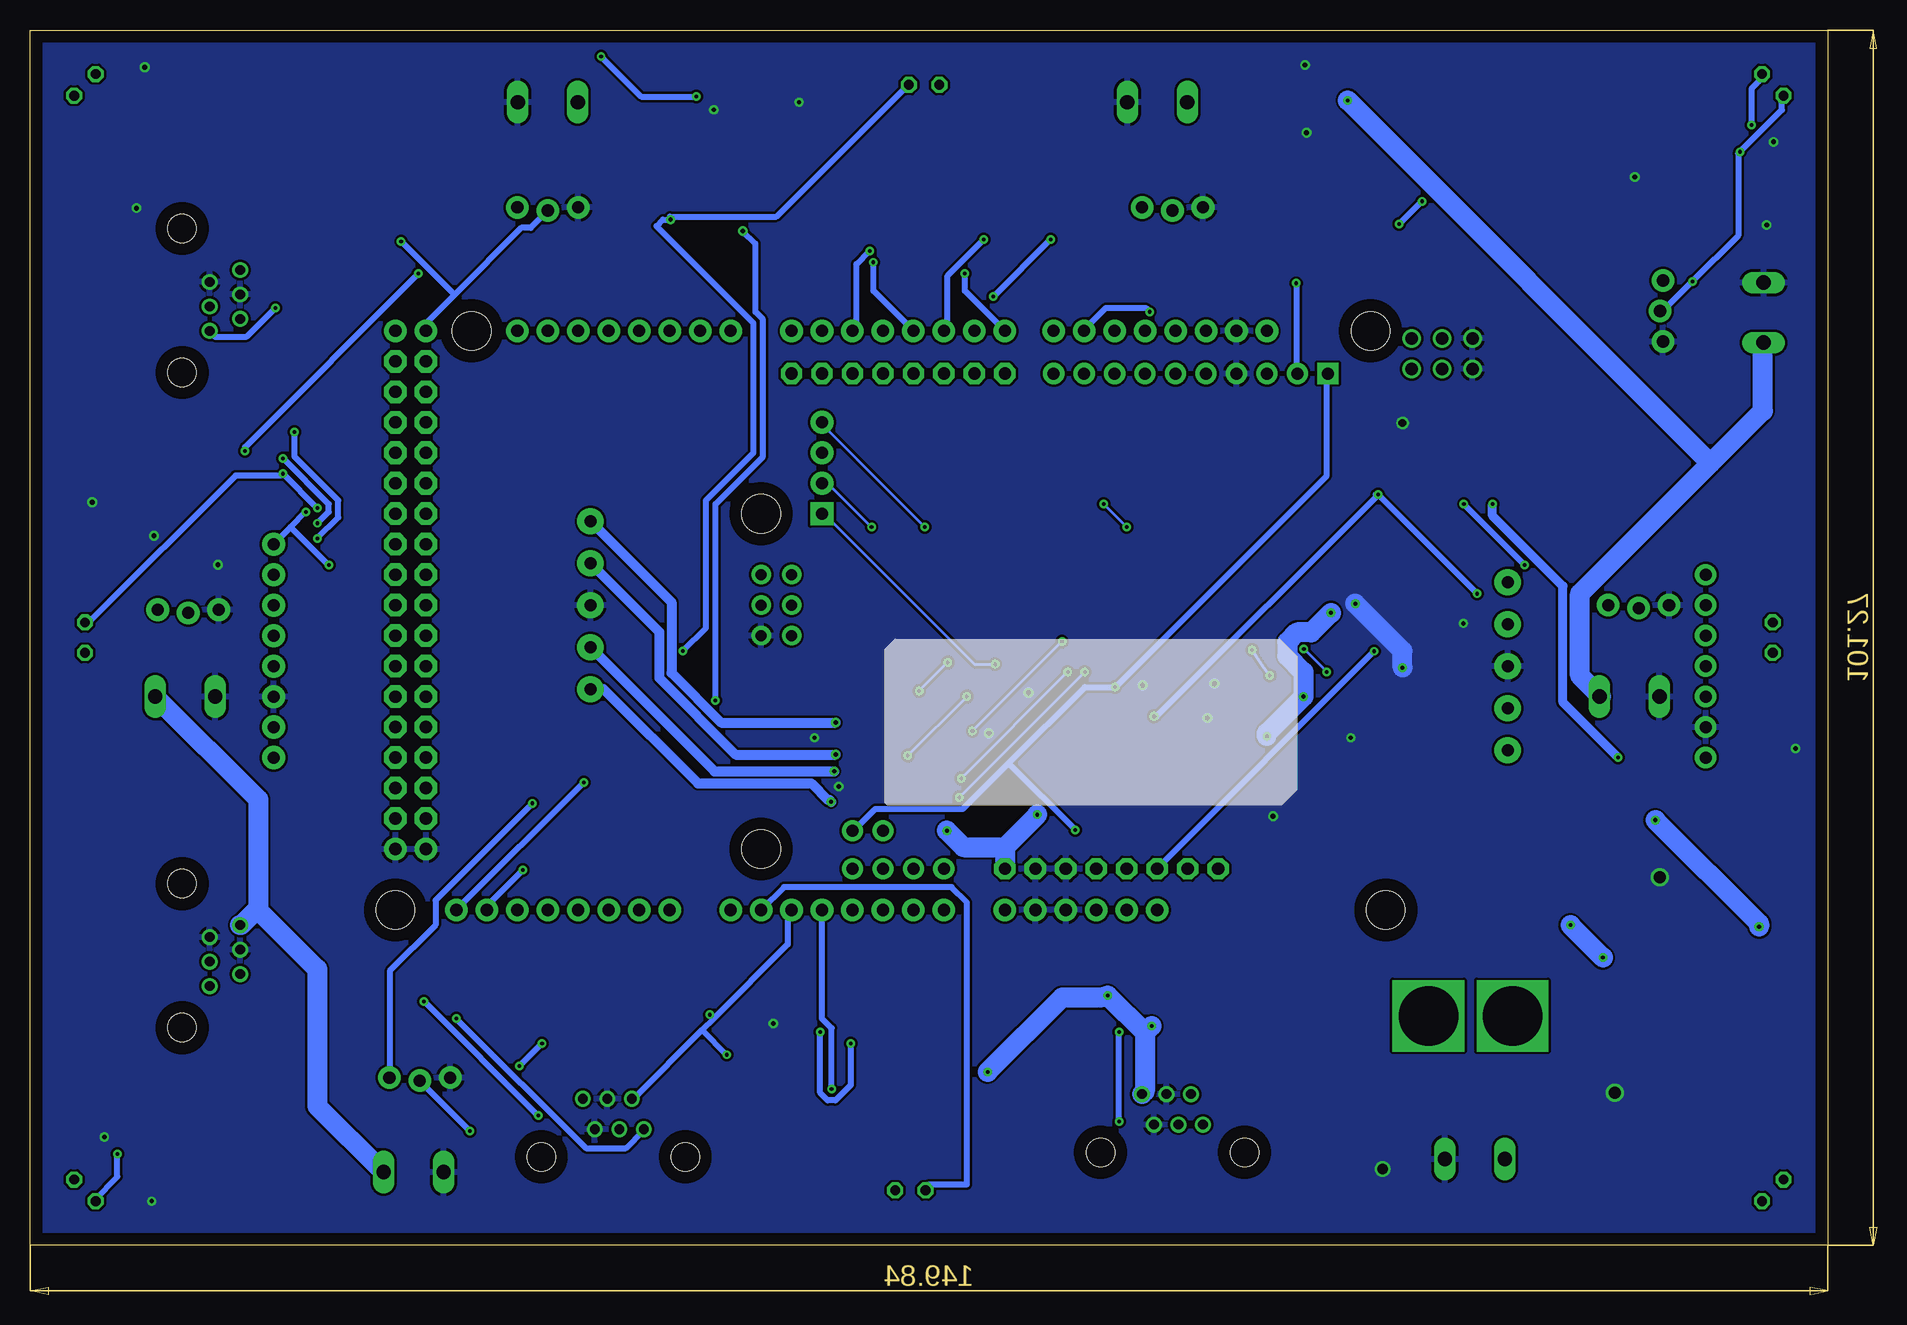
[diagram p6: board, bottom side, seen from below]

Size 149.84 x 101.27 mm. Coordinates in mm from the lower left corner, seen from the top.
Outline: 0,0 149.84,0 149.84,101.27 0,101.27 0,0
Copper layers (1*16): Top 0.035mm / dielectric 1.5mm / Bottom 0.035mm
Design rules "PcbWay *": minimum track width 6mil, minimum drill 0.3mm, track to track 0.205mm, track to pad 0.205mm, pad to pad 0.205mm, via to via 0.205mm, smd to smd 8mil, copper to edge 40mil, drill to drill 0.300228125mm, minimum pad ring 10mil, minimum via ring 8mil, stop-mask expansion 4mil, vias tented up to drill 25mil, thermal gap 10mil

### Footprints (pad centres in the part's own frame; a part is rotated, then mirrored left to right if it is on the bottom)
ARDUINO_MEGA = drill 1.016 pad 1.88: 0 13.97,24.13; 1 11.43,24.13; 2 8.89,24.13; 3 6.35,24.13; 3.3V -13.97,-24.13; 4 3.81,24.13; 5 1.27,24.13; 5V@0 -11.43,-24.13; 5V@1 44.45,24.13; 5V@2 46.99,24.13; 6 -1.27,24.13; 7 -3.81,24.13; 8 -7.874,24.13; 9 -10.414,24.13; 10 -12.954,24.13; 11 -15.494,24.13; 12 -18.034,24.13; 13 -20.574,24.13; 14 19.05,24.13; 15 21.59,24.13; 16 24.13,24.13; 17 26.67,24.13; 18 29.21,24.13; 19 31.75,24.13; 20 34.29,24.13; 21 36.83,24.13; A0 1.27,-24.13; A1 3.81,-24.13; A2 6.35,-24.13; A3 8.89,-24.13; A4 11.43,-24.13; A5 13.97,-24.13; A6 16.51,-24.13; A7 19.05,-24.13; A8 24.13,-24.13; A9 26.67,-24.13; A10 29.21,-24.13; A11 31.75,-24.13; A12 34.29,-24.13; A13 36.83,-24.13; A14 39.37,-24.13; A15 41.91,-24.13; AREF -25.654,24.13; GND@0 -8.89,-24.13; GND@1 -6.35,-24.13; GND@2 44.45,-19.05; GND@3 46.99,-19.05; GND@4 -23.114,24.13; RESET -16.51,-24.13; VIN -3.81,-24.13 | drill 1.016 pad 1.88 octagon: 22 44.45,21.59; 23 46.99,21.59; 24 44.45,19.05; 25 46.99,19.05; 26 44.45,16.51; 27 46.99,16.51; 28 44.45,13.97; 29 46.99,13.97; 30 44.45,11.43; 31 46.99,11.43; 32 44.45,8.89; 33 46.99,8.89; 34 44.45,6.35; 35 46.99,6.35; 36 44.45,3.81; 37 46.99,3.81; 38 44.45,1.27; 39 46.99,1.27; 40 44.45,-1.27; 41 46.99,-1.27; 42 44.45,-3.81; 43 46.99,-3.81; 44 44.45,-6.35; 45 46.99,-6.35; 46 44.45,-8.89; 47 46.99,-8.89; 48 44.45,-11.43; 49 46.99,-11.43; 50 44.45,-13.97; 51 46.99,-13.97; 52 44.45,-16.51; 53 46.99,-16.51 | hole 3.2: -34.29,24.13; -35.56,-24.13; 16.51,8.89; 16.51,-19.05; 40.64,24.13; 46.99,-24.13
W237-102 = drill 1.194 long: 1 -2.5,-1.27; 2 2.5,-1.27
C0805 = smd 1.3 x 1.5: 1 -0.95,0; 2 0.95,0
0805-NO = smd 1.3 x 1.5: 1 -0.95,0; 2 0.95,0
PANASONIC_C = smd 2.6 x 1.4: + 2.05,0; - -2.05,0
1X04-CLEANBIG = drill 1.016 pad 1.778: 1 -3.81,0; 2 -1.27,0; 3 1.27,0; 4 3.81,0
1X07_ROUND_70 = drill 1 pad 1.778: 1 -7.62,0; 2 -5.08,0; 3 -2.54,0; 4 0,0; 5 2.54,0; 6 5.08,0; 7 7.62,0
1X08-CLEANBIG = drill 1.016 pad 1.778 octagon: 1 -8.89,0; 2 -6.35,0; 3 -3.81,0; 4 -1.27,0; 5 1.27,0; 6 3.81,0; 7 6.35,0; 8 8.89,0
1X03_LOCK = drill 1.016 pad 1.88: 1 0,0.127; 2 2.54,-0.127; 3 5.08,0.127
TO263-3 = smd 1.067 x 2.159: 1 -2.54,-5.791; 2 0,-5.791; 3 2.54,-5.791 | smd 10.8 x 10.41: TAB 0,2.54
SSOP24 = smd 0.4 x 1.25: 1 -3.575,-3.625; 2 -2.925,-3.625; 3 -2.275,-3.625; 4 -1.625,-3.625; 5 -0.975,-3.625; 6 -0.325,-3.625; 7 0.325,-3.625; 8 0.975,-3.625; 9 1.625,-3.625; 10 2.275,-3.625; 11 2.925,-3.625; 12 3.575,-3.625; 13 3.575,3.625; 14 2.925,3.625; 15 2.275,3.625; 16 1.625,3.625; 17 0.975,3.625; 18 0.325,3.625; 19 -0.325,3.625; 20 -0.975,3.625; 21 -1.625,3.625; 22 -2.275,3.625; 23 -2.925,3.625; 24 -3.575,3.625
1X08_ROUND_76 = drill 1 pad 1.93: 1 -8.89,0; 2 -6.35,0; 3 -3.81,0; 4 -1.27,0; 5 1.27,0; 6 3.81,0; 7 6.35,0; 8 8.89,0
LED5MM = drill 0.813 octagon: A -1.27,0; K 1.27,0
AVRISP = drill 0.9 pad 1.626: 1 -1.27,2.54; 2 1.27,2.54; 3 -1.27,0; 4 1.27,0; 5 -1.27,-2.54; 6 1.27,-2.54
1X05-3.5MM = drill 1 pad 2.184: 1 7,0; 2 3.5,0; 3 0,0; 4 -3.5,0; 5 -7,0
1X04_ROUND_76 = drill 1 pad 1.93 square: 1 -3.81,0 | drill 1 pad 1.93: 2 -1.27,0; 3 1.27,0; 4 3.81,0
1X10_ROUND70 = drill 1 pad 1.778 square: 1 -11.43,0 | drill 1 pad 1.778: 2 -8.89,0; 3 -6.35,0; 4 -3.81,0; 5 -1.27,0; 6 1.27,0; 7 3.81,0; 8 6.35,0; 9 8.89,0; 10 11.43,0
1X02_ROUND = drill 1 pad 1.778: 1 -1.27,0; 2 1.27,0
CHIPLED_0805_NOOUTLINE = smd 1.2 x 1.2: A 0,-1.05; C 0,1.05
D-PAK_TO252AA = smd 1 x 1.6: 1 -2.28,-4.8; 3 2.28,-4.8 | smd 5.4 x 6.2: 4 0,2.5
R0603 = smd 1 x 1.1: 1 -0.85,0; 2 0.85,0
1X03 = drill 1.016: 1 -2.54,0; 2 0,0; 3 2.54,0
EVQ-Q2 = smd 3.2 x 1.2: A -3.4,-2; A' 3.4,-2; B -3.4,2; B' 3.4,2
TSSOP28 = smd 0.305 x 0.991: 1 -4.225,-2.918; 2 -3.575,-2.918; 3 -2.925,-2.918; 4 -2.275,-2.918; 5 -1.625,-2.918; 6 -0.975,-2.918; 7 -0.325,-2.918; 8 0.325,-2.918; 9 0.975,-2.918; 10 1.625,-2.918; 11 2.275,-2.918; 12 2.925,-2.918; 13 3.575,-2.918; 14 4.225,-2.918; 15 4.225,2.918; 16 3.575,2.918; 17 2.925,2.918; 18 2.275,2.918; 19 1.625,2.918; 20 0.975,2.918; 21 0.325,2.918; 22 -0.325,2.918; 23 -0.975,2.918; 24 -1.625,2.918; 25 -2.275,2.918; 26 -2.925,2.918; 27 -3.575,2.918; 28 -4.225,2.918
TOGGLESWITCH = drill 4.953 square: IN 0,0; OUT 0,-7.01
NXT-SOCKET = drill 0.8 pad 1.3: 1 2.54,4.84; 2 1.54,2.3; 3 0.5,4.84; 4 -0.5,2.3; 5 -1.54,4.84; 6 -2.54,2.3 | hole 2.36: -6,0; 6,0

### Placement (x,y rotation side)
B1  72.39,52.07 0 top
BATERY  29.4,8.45 0 top
C1  30.86,67.31 0 top
C7  48.58,45.59 0 top
C8  49.02,48.01 0 top
C11  69.47,40.01 180 top
C12  71.25,47.12 0 top
C13  36.58,40.77 0 top
C15  42.55,43.31 0 top
C16  70.23,35.69 180 top
CN2  77.47,31.37 180 top
COLORSENSOR2  10.16,48.26 90 top
D0-1  77.47,72.64 180 top
ESC1  13.84,75.31 90 top
ESC1P  6.6,77.72 270 top
ESC2  114.81,13.84 0 top
ESC2P  117.86,7.37 0 top
ESC3  104.14,86.36 0 top
ESC3P  106.68,93.98 180 top
ESC4  52.07,86.36 0 top
ESC4P  55.88,93.98 180 top
ESC5  13.21,53.21 0 top
ESC5P  16.51,46.99 0 top
ESC6  134.11,52.83 0 top
ESC6P  136.91,46.99 0 top
IC1  12.95,19.18 90 top
IC2  36.83,48.39 270 top
IC4  77.22,40.26 90 top
IMU2  129.54,49.53 270 top
IR1  4.57,50.63 90 top
IR2  4.57,96.7 225 top
IR3  145.26,96.7 315 top
IR4  145.26,50.63 270 top
IR5  145.26,4.57 45 top
IR6  4.57,4.57 135 top
IR7  76.45,4.57 0 top
IR8  75.31,96.7 180 top
ISP1  87.63,53.34 0 top
J3  26.67,48.26 270 top
J4  103.12,53.34 270 top
JP5  83.82,64.77 90 top
JP6  59.69,31.37 180 top
JP7  53.09,72.64 0 top
JP8  80.01,34.54 180 top
LED2  38.23,35.69 270 top
Q1  9.4,30.73 90 top
R1  3.68,11.18 270 top
R2  144.78,11.18 270 top
R3  144.91,58.17 90 top
R4  5.08,40.51 270 top
R5  4.95,89.28 90 top
R6  137.54,98.17 0 top
R7  43.05,35.69 180 top
R8  83.31,96.77 0 top
R9  68.2,4.7 180 top
R15  61.15,40.64 90 top
R16  58.42,40.89 90 top
R17  55.88,40.64 90 top
R19  53.34,40.51 90 top
R20  50.55,40.64 270 top
R21  42.93,70.61 180 top
R22  38.23,71.12 180 top
SERVO3  32.13,75.56 0 top
SERVO4  32.13,73.03 0 top
SW2  28.32,61.34 180 top
U1  57.66,48.01 90 top
U$2  33.27,19.11 270 top
U$17  [ADAFRUIT_TEXT_30MM]  77.98,38.1 0 bottom
U$18  [ADAFRUIT_3.5MM]  63.25,36.32 0 top
X1  137.16,24.13 90 top
X2  137.16,78.74 90 top
X3  54.61,7.75 0 top
X4  101.22,7.37 0 top

### Tracks (layer width: path | path; a pad name or v marks a point on that pad's centre or on a via)
3.3V  (via drill 0.3)
  Top 0.508: JP6.5 B1.3.3V 58.58,27.78 58.58,17.78 v59.05,17.78 | v117,20.32 131.76,20.32 133.03,21.59 133.51,21.59 133.51,22.23 134.78,23.5 X1.4 134.78,23.81 133.67,23.81 133.67,26.99 132.72,27.94 125.89,27.94 v125.89,58.9 | v107.47,10.79 102.08,10.79 100.97,9.68 X4.4 100.65,9.53 99.54,8.41 98.27,8.41 96.52,10.16 67.47,10.16 67.31,10.32 v59.05,10.32 57.72,10.32 57.72,9.72 56.45,8.45 55.71,8.45 X3.4 | v127.79,67.79 133.35,73.34 133.51,73.34 133.51,76.83 134.78,78.11 X2.4
  Bottom 0.508: v107.47,10.79 v117,20.32 | v127.79,67.79 127.79,65.72 124.14,62.07 124.14,60.64 v125.89,58.9 | v59.05,10.32 v59.05,17.78
5.5V  (via drill 0.3)
  Top 0.152: IC4.19 73.59,39.3 73.6,39.29
  Top 0.254: 53.66,45.28 53.91,45.02 53.91,44.14 54.11,43.95 54.58,43.95 U1.28 | IC4.20 73.6,39.29
  Top 0.406: IC2.20 IC2.19 41.02,49.28 41.02,48.74
  Top 0.508: IR3.K 146.05,95.73 138.75,95.73 138.75,91.12 139.06,90.81 139.06,88.9 139.7,88.27 | 139.54,67.31 139.54,72.07 139.7,72.23 139.7,82.23 | 139.7,88.27 139.7,88.58 139.22,88.58 | 139.7,88.27 139.7,82.23 | B1.5V@2 B1.5V@1 | 96.04,97.79 96.36,97.47 97.16,97.47 99.69,94.93 | 99.69,94.93 106.68,87.95 ESC3.2 | 139.7,82.23 133.19,82.23 131.76,83.66 v118.9,83.66 | R21.2 41.91,70.48 41.27,69.85 38.26,69.85 37.31,70.8 37.31,71.12 R22.2 37.15,71.28 36.67,71.75 34.16,71.75 33.37,72.55 33.37,77.79 13.97,77.79 ESC1.2 | 64.77,93.5 61.75,93.5 54.61,86.36 ESC4.2 54.45,86.52 50.96,90.01 35.72,90.01 34.92,90.81 | v7.3,91.12 9.53,88.9 10.16,88.9 10.32,88.9 14.61,88.9 16.51,90.81 34.92,90.81 | 34.61,91.12 34.92,90.81 | 99.69,94.93 96.52,91.76 79.22,91.76 74.3,96.68 IR8.K 73.98,96.68 73.03,95.73 66.83,95.73 64.93,93.82 64.77,93.98 64.77,93.5 | 67.94,8.89 71.12,5.71 76.52,5.71 77.63,4.6 IR7.K 77.95,4.45 78.9,3.49 113.19,3.49 | 135.41,3.65 137.16,5.4 146.05,5.4 IR5.K 146.21,5.71 146.21,8.89 146.69,9.37 146.69,37.78 145.41,37.78 144.62,38.58 | 135.41,3.65 135.25,3.49 | 143.99,49.21 143.99,43.18 | 143.99,43.18 143.99,41.12 144.15,40.96 144.15,38.73 144.78,38.73 144.62,38.58 | 143.99,49.21 145.26,49.21 IR4.K | ESC6.2 136.68,52.7 140.02,49.37 143.83,49.37 143.99,49.21 | 143.99,43.18 IMU2.7 | 144.46,38.73 144.62,38.58 | 134.94,3.49 113.19,3.49 | 13.34,4.45 12.38,5.4 6.67,5.4 | 6.67,5.4 3.81,5.4 IR6.K | 4.13,57.31 4.13,51.91 4.45,51.91 IR1.K 4.76,51.75 5.87,51.75 5.87,44.93 9.05,41.75 | 4.13,57.31 4.13,58.9 | 9.05,41.75 COLORSENSOR2.1 | 4.13,57.31 11.27,57.31 | 11.27,57.31 11.59,57.31 15.72,53.18 ESC5.2 15.88,53.34 20.16,57.63 31.59,57.63 36.67,52.55 36.67,43.34 36.83,43.18
  Top 0.508: 6.67,5.4 6.67,2.54 2.7,2.54 1.75,3.49 1.75,38.58 5.87,38.58 9.05,41.75 | 90.65,21.43 90.17,20.95 89.53,20.95 89.22,20.64 89.22,16.83 | 89.22,16.83 92.08,16.83 93.03,15.88 114.94,15.88 117,13.81 117.32,13.81 ESC2.2 | 37.15,36.83 37.15,39.53 36.83,39.85 36.83,43.18 | 37.15,36.83 37.15,35.72 LED2.A | 36.83,43.18 41.59,43.18 C15.1 41.75,43.5 41.75,44.61 44.29,44.61 44.77,44.13 46.35,44.13 47.47,45.24 C7.1 | U1.28 54.61,43.81 53.98,43.81 53.66,44.13 53.66,46.35 54.61,46.35 U1.24 | 40.64,48.74 41.02,48.74 45.88,48.74 46.35,49.21 C8.1 46.35,48.9 47.31,47.94 47.47,47.94 47.47,45.56 C7.1 | C7.1 47.62,45.4 47.67,45.4 48.69,44.38 50.37,44.38 51.26,45.28 53.66,45.28 | B1.5V@0 JP6.4 61.12,31.43 64.14,34.45 | 71.28,39.85 70.64,39.85 70.48,40.01 C11.1 | 73.15,39.85 73.34,39.85 | 73.15,39.85 71.28,39.85 | 71.28,39.85 71.28,35.72 C16.1 71.28,35.56 70.17,34.45 | ISP1.2 90.33,54.45 90.33,45.72 80.33,45.72 74.45,39.85 74.15,39.85 | 73.82,39.85 74.15,39.85 | 70.17,34.45 64.14,34.45 | 37.15,36.83 48.58,36.83 49.85,35.56 63.02,35.56 64.14,34.45 | 89.22,16.83 82.87,16.83 73.18,26.51 73.03,26.51 70.33,29.21 70.33,34.29 70.17,34.45 | v113.19,9.53 113.19,3.81 | 113.19,3.81 113.19,3.49 | 11.27,57.31 v11.27,80.33 | 74.15,39.85 73.6,39.29 73.6,39.4 73.15,39.85 | 113.19,3.81 135.25,3.81 135.41,3.65 | 113.03,3.81 113.19,3.81 | 64.77,93.34 64.77,93.5
  Bottom 0.508: B1.5V@1 116.84,76.83 114.46,79.22 | 114.46,79.22 108.9,84.77 108.11,84.77 106.68,86.2 ESC3.2 | 114.46,79.22 v118.9,83.66 | IR2.K 3.81,95.73 3.81,94.61 v7.3,91.12 7.46,90.96 7.46,84.14 v11.27,80.33 13.65,77.95 13.97,77.95 ESC1.2 | v113.19,9.53 117.32,13.65 ESC2.2
A0
  Top 0.254: 62.07,42.39 61.75,42.7 61.59,42.7 60.64,43.66 U1.1
  Top 0.508: R15.2 60.64,42.1 60.64,43.66
A0A
  Top 0.508: B1.A0 CN2.4
A1
  Top 0.254: 59.53,43.97 59.85,44.29 60.48,44.29 U1.2 60.58,44.42 60.55,44.39
  Top 0.406: U1.2 60.55,44.39 59.96,44.39 58.42,42.85 R16.2
A1A
  Top 0.508: B1.A1 CN2.3
A2
  Top 0.254: 59.69,44.93 60.33,44.93 60.48,45.09 U1.3
  Top 0.406: U1.3 60.53,45.04 59.63,45.04 56.19,41.59 R17.2
A2A
  Top 0.508: B1.A2 CN2.2
A3
  Top 0.254: U1.4 60.48,45.72 59.05,45.72 56.04,42.7 55.09,42.7 53.85,41.46 R19.2
A3A
  Top 0.508: B1.A3 CN2.1
A4
  Top 0.254: U1.5 60.64,46.35 61.12,46.35 62.55,44.93 62.55,38.58 51.75,38.58 50.64,39.69 R20.2
A6  (via drill 0.3, 0.35)
  Top 0.508: v92.71,45.4 92.71,30.32 91.28,30.32 B1.A6 | v90.42,84.52 90.42,86.08 | R9.1 69.06,4.6 75.09,4.6 IR7.A 75.41,4.45 77.63,2.22 148.11,2.22 148.11,97.31 146.21,99.22 102.39,99.22 v102.23,99.06 | 91.12,95.41 91.44,95.73 v94.3,95.73
  Bottom 0.508: v92.71,45.4 92.71,61.75 88.74,65.72 88.74,77.15 89.38,77.79 89.38,83.47 v90.42,84.52 | v94.3,95.73 98.9,95.73 v102.23,99.06 | B1.A6 87,29.84 73.03,29.84 71.75,28.57 71.75,5.08 74.93,5.08 IR7.A
A7  (via drill 0.3, 0.35)
  Top 0.508: v95.41,49.53 95.41,30 93.5,30 B1.A7 | v96.46,85.47 95.48,85.47 | IR8.A 76.68,96.84 82.39,96.84 R8.1 82.55,96.68 86.68,92.55 94.46,92.55 95.89,93.98
  Bottom 0.508: v95.41,49.53 93.5,51.44 93.5,62.07 89.53,66.04 89.53,76.83 97.63,84.93 97.09,85.47 v96.46,85.47 96.52,85.72 87.63,85.72 76.83,96.52 IR8.A
A10  (via drill 0.3)
  Top 0.508: B1.A10 99.38,25.72 89.95,25.72 88.41,24.17 | 88.41,24.17 | 2.54,6.67 2.54,3.81 5.4,3.81 IR6.A | 2.54,6.67 2.54,10.95 3.02,11.43 3.17,11.43 3.65,11.91 R1.1 | v83.98,17.78 84.61,18.41 85.25,18.41 85.72,18.89 85.72,21.59 88.27,24.13 88.41,24.17 | v81.44,16.83 81.28,16.67 66.52,16.67 64.77,14.92 36.47,14.92 28.26,6.71 28.26,5.72 27.46,4.92 18.74,4.92 17.78,3.97 15.4,6.35 4.45,6.35 4.13,6.67 2.54,6.67
  Bottom 0.508: v83.98,17.78 83.98,12.7 83.34,12.06 82.71,12.06 81.44,13.34 v81.44,16.83
A11  (via drill 0.3)
  Top 0.508: B1.A11 101.12,24.92 98.17,24.92 97.95,24.92 97.79,24.92 | 97.72,24.92 97.79,24.92 | 143.03,10.32 142.56,9.84 v142.56,7.62 | 143.03,10.32 144.15,11.43 144.3,11.43 144.78,11.91 R2.1 | 92.08,17.62 92.39,17.62 93.19,16.83 v107.16,16.83 | 92.08,17.62 90.81,17.62 | v109.06,14.92 110.33,13.65 113.03,13.65 116.2,10.48 142.88,10.48 143.03,10.32 | 92.08,17.62 92.08,24.77 97.79,24.77 97.79,24.92
  Bottom 0.508: v142.56,7.62 142.56,5.71 144.46,3.81 IR5.A | v109.06,14.92 v107.16,16.83
A12  (via drill 0.3)
  Top 0.508: v125.89,61.44 120.81,56.36 120.81,30.96 109.7,30.96 B1.A12 | 129.01,64.03 v128.75,64.29 | IR4.A 145.26,51.91 144.94,51.91 144.94,57.31 R3.1 144.78,57.47 143.35,57.47 136.68,64.14 135.1,64.14 134.62,64.61
  Bottom 0.508: v125.89,61.44 v128.75,64.29 128.91,64.14 132.72,64.14 144.78,52.07 IR4.A
A13  (via drill 0.3)
  Top 0.508: v125.89,60.17 122.4,56.67 122.4,24.92 112.24,24.92 B1.A13 | v128.75,65.56 132.56,69.37 | 132.56,69.37 132.84,69.66 | R6.1 136.84,98.11 136.84,97.16 143.99,97.16 144.3,97.47 IR3.A 144.15,97 147.32,97 147.32,68.74 142.4,63.82 139.86,63.82 139.62,63.58 | 139.62,63.58 139.54,63.5 | 132.56,69.37 138.43,63.5 139.7,63.5 139.62,63.58
  Bottom 0.508: v128.75,65.56 124.94,61.75 124.94,61.12 v125.89,60.17
A14  (via drill 0.3)
  Top 0.508: v64.77,83.82 35.56,83.82 | 35.56,83.82 34.77,83.82 34.28,84.3 | v69.53,79.06 70.96,77.63 87.95,77.63 103.66,61.91 103.82,61.91 108.9,56.83 108.9,31.27 v108.74,31.27 | 6.35,89.69 5.71,89.06 5.56,89.06 5.08,88.58 R5.1 | v6.35,93.34 6.35,89.69 | 37.31,86.68 37.31,85.09 v35.72,85.09 35.56,85.09 35.56,83.82 | v33.81,87 33.34,87.47 8.57,87.47 6.35,89.69
  Bottom 0.508: v69.53,79.06 v64.77,83.82 | v108.74,31.27 111.76,28.26 B1.A14 | v6.35,93.34 6.35,96.36 5.56,97.16 5.56,97.47 IR2.A | v33.81,87 v35.72,85.09
A15  (via drill 0.3)
  Top 0.508: v103.66,38.58 101.44,38.58 101.44,46.04 90.17,57.31 84.77,57.31 81.28,60.8 12.22,60.8 12.22,80.96 13.26,81.99 | 13.26,81.99 13.63,82.37 | R4.1 5.08,49.21 4.6,49.21 IR1.A 4.45,49.53 2.22,49.53 2.22,96.04 2.62,96.44 | 38.58,91.76 38.58,98.74 4.92,98.74 2.62,96.44 | 2.62,96.44 2.54,96.52 2.54,88.9 9.53,81.92 13.34,81.92 13.26,81.99
  Bottom 0.508: B1.A15 v103.66,38.58
AREF
  Top 0.508: JP7.3 46.67,72.71 46.67,76.2 B1.AREF
BAT+  (via drill 0.3, 0.35)
  Top 0.152: IC4.13 IC4.14 | IC4.24 73.59,36.1 | 40.47,51.97 IC2.24 | IC2.13 40.45,45.4 41.04,45.4
  Top 0.254: IC2.14 40.45,45.4
  Top 0.508: v41.4,52.7 41.2,52.7 | 41.2,52.7 40.47,51.97 40.98,51.97 41.49,52.48 41.15,52.83 40.89,52.83 | 41.2,52.7 40.51,52.7 40.26,52.45 40.26,52.16 40.45,51.97
  Top 0.61: 41.84,45.58 41.67,45.4 41.04,45.4 IC2.13
  Top 1.016: v43.69,45.72 41.99,45.72 41.84,45.58
  Top 1.651: X2.1 132.24,81.28 131.29,82.23 118.11,82.23 105.09,95.25 ESC3P.2 103.5,95.73 99.85,99.38 57.63,99.38 53.5,95.25 ESC4P.2 52.7,95.41 v40.01,95.41 | 103.82,12.22 112.55,12.22 115.73,9.05 117.47,9.05 120.33,6.19 ESC2P.2 | 103.82,12.22 X4.1 | v60.01,20.8 65.09,25.88 66.83,25.88 68.58,27.62 B1.VIN JP6.1 | 73.5,44.29 73.5,46.99 73.34,46.99 C12.+ | 73.5,44.29 73.5,43.97 IC4.13 | 63.9,37.86 66.83,40.8 66.83,44.29 73.5,44.29 | 63.9,37.86 63.34,37.31 50.01,37.31 49.05,38.26 41.12,38.26 38.73,40.64 C13.+ 45.09,40.77 v46.74,42.42 | 63.9,37.86 v65.88,35.88 | 14.53,35.64 18.89,40.01 18.89,45.72 ESC5P.2 | 14.53,35.64 14.29,35.4 | v18.73,23.97 18.73,21.75 IC1.3 | v56.36,18.26 50.16,24.45 23.81,24.45 22.07,26.19 v21.43,26.67 21.43,28.54 15.43,34.55 15.24,34.55 v14.35,35.43 14.61,35.56 14.53,35.64 | v70.01,14.45 102.23,14.45 103.66,13.02 103.82,12.22 | v73.41,34.54 73.59,34.73 73.59,36.1 | v5.71,26.54 5.71,29.55 Q1.4
  Bottom 1.651: 130.89,28.02 130.81,28.1 130.81,37.15 139.38,45.72 ESC6P.2 | 130.89,28.02 132.24,26.67 X1.1 | 130.89,28.02 125.89,23.02 125.89,11.59 120.49,6.19 ESC2P.2 | 56.91,17.7 v60.01,20.8 60.8,20.64 63.82,20.64 v70.01,14.45 | 68.58,33.18 JP6.1 | v65.88,35.88 68.58,33.18 | v21.43,26.67 v18.73,23.97 | 9.76,65.17 20.64,54.29 20.64,47.47 18.89,45.72 ESC5P.2 | 9.76,65.17 5.4,69.53 5.4,75.09 ESC1P.2 | v56.36,18.26 56.91,17.7 | 9.76,65.17 v40.01,95.41 | v46.74,42.42 46.74,42.67 v43.69,45.72 43.69,47.76 45.04,49.12 45.04,50.26 44.23,51.07 43.03,51.07 v41.4,52.7 | v73.41,34.54 72.04,33.18 68.58,33.18 | 56.91,17.7 56.91,12.82 X3.1 | v14.35,35.43 5.71,26.8 v5.71,26.54
D0
  Top 0.508: B1.0 D0-1.1
D1
  Top 0.508: B1.1 D0-1.2
D2  (via drill 0.3)
  Top 0.508: B1.2 D0-1.3 | ESC1.3 16.19,82.87 v79.85,82.87
  Bottom 0.508: v79.85,82.87 80.96,81.76 80.96,76.52 B1.2
D3  (via drill 0.3)
  Top 0.508: B1.3 D0-1.4 78.9,72.55 80.17,71.28 85.09,71.28 101.12,55.24 107.95,55.24 v107.95,36.83
  Bottom 0.508: v107.95,36.83 116.05,28.73 116.05,26.67 119.86,22.86 119.86,13.97 ESC2.3
D4  (via drill 0.3)
  Top 0.508: B1.4 D0-1.5 | v79.53,81.92 104.78,81.92 109.22,86.36 ESC3.3
  Bottom 0.508: v79.53,81.92 79.53,79.53 B1.4
D5  (via drill 0.3)
  Top 0.508: B1.5 D0-1.6 | v70.33,83.82 69.37,84.77 58.74,84.77 57.15,86.36 ESC4.3
  Bottom 0.508: v70.33,83.82 73.34,80.8 73.34,76.52 B1.5
D6  (via drill 0.3)
  Top 0.508: B1.6 D0-1.7 70.96,72.55 69.69,71.28 68.26,71.28 58.58,61.59 30.48,61.59 v30.32,61.75 | v25.24,56.67 21.75,56.67 18.41,53.34 ESC5.3
  Bottom 0.508: v30.32,61.75 v25.24,56.67
D7  (via drill 0.3)
  Top 0.508: B1.7 D0-1.8 | v131.92,66.2 131.92,62.55 139.06,55.4 139.06,53.02 ESC6.3 | v71.91,80.96 v117.47,80.96
  Bottom 0.508: v131.92,66.2 131.92,66.52 v117.47,80.96 | v71.91,80.96 71.91,79.53 B1.7
D8
  Top 0.508: JP7.10 64.45,72.71 64.45,76.2 B1.8
D9  (via drill 0.3)
  Top 0.508: v56.52,77.79 44.29,77.79 39.69,73.18 35.08,73.18 34.92,73.03 SERVO4.3 | JP7.9 61.91,72.71 61.91,76.2 B1.9
  Bottom 0.508: v56.52,77.79 56.83,78.11 60.17,78.11 62.07,76.2 B1.9
D10
  Top 0.508: SERVO3.3 34.92,75.56 34.92,79.22 56.36,79.22 59.37,76.2 B1.10 59.37,76.04 59.37,72.71 JP7.8
D11
  Top 0.508: JP7.7 56.83,72.71 56.83,76.2 B1.11
D12
  Top 0.508: JP7.6 54.29,72.71 54.29,76.2 B1.12
D13
  Top 0.508: JP7.5 51.75,72.71 51.75,76.2 B1.13
GND  (via drill 0.35, 0.4, 0.65, 0.85, 1)
  Top 0.152: IC4.9 80.84,42.43 80.89,42.48 | 72.45,40.58 IC4.18 | IC2.10 33.38,46.29 33.38,46.59
  Top 0.254: U1.25 55.87,45.73 55.88,45.72 55.88,46.36 55.37,46.87 55.07,46.87 54.86,47 54.78,46.99 U1.23 | R3.2 144.65,59.27 v144.65,61.91 | v140.27,98.17 R6.2
  Top 0.305: 72.45,40.58 71.75,40.58 71.22,41.11 69.62,41.11 69.47,40.96 68.83,40.96 68.83,40.89 69.03,40.7 69.03,40.51 C11.2
  Top 0.406: v35.43,48.13 34.06,46.76 33.25,46.76 | IC2.9 | IC2.9 33.25,46.76 | 33.25,46.76 33.91,46.1 33.91,46.48 33.48,46.48 33.38,46.59 IC2.9 | IC2.4 33.48,50.29 33.91,50.29 | 33.91,50.29 33.91,49.97 | 33.91,50.29 33.91,50.67 34.16,50.67 35.43,49.4 | IC2.4 32.61,50.01 32.6,50.03 31.76,50.03 31.75,50.04 32,50.29 32.92,50.29 IC2.4 | IC2.4 33.17,50.01 32.51,50.67 | IC2.18 40.44,48.07 39.69,48.07 39.42,48.34 39.42,53.42 v39.37,53.47
  Top 0.508: R2.2 143.64,9.18 v143.64,9.02 | 80.84,38.04 82.23,38.04 v82.42,38.23 81.92,38.23 81.66,38.48 81.28,38.48 80.84,38.04 | v84.45,42.29 81.66,42.29 81.41,42.04 81.34,42.04 80.89,42.48 80.31,41.89 80.03,41.89 79.76,41.62 79.76,38.89 80.03,38.62 80.25,38.62 80.84,38.04 | R8.2 84.16,96.18 84.71,95.63 84.71,96.39 84.84,96.52 84.42,96.52 R8.2 | R8.2 84.29,96.65 85.06,96.65 85.72,95.99 v85.72,95.25 | 91.95,94.36 92.2,94.61 v92.84,94.61 | 43.24,42.2 42.54,42.2 42.44,42.1 39.95,42.1 v39.75,42.29 | C7.2 50.61,46.67 v51.12,46.8 | R4.2 4.34,40.4 | 4.34,40.4 | v2.67,41.4 3.34,41.4 4.34,40.4
  Top 0.813: C15.2 43.24,43.06 | 43.24,43.06 43.24,42.2 | 43.24,42.2 42.76,42.2 | 44.45,42.2 43.24,42.2 | 43.24,43.06 43.44,42.86 44.32,42.86 43.75,42.29 42.84,42.29
  Top 1.016: R17.1 56.13,39.94 R16.1 60.9,39.94 R15.1
  Bottom 1.651: v35.43,48.13 35.43,49.53 v39.37,53.47
  other vias: 30.35,51.82 139.7,3.68 87.88,18.48 17.72,12.7 13.97,30.67 69.91,42.67 66.61,46.04 51.69,43.94 134.18,56.71 139.51,59.12 4.51,91.95 5.08,85.03 16.07,89.03 140.97,86.42 46.23,35.75 57.09,46.67 43.56,98.36 43.43,92.71 35.43,68.52 37.08,6.35
  pour Top: 0.25,100.84 149.61,100.84 149.61,0.25 0.25,0.25
  pour Bottom: 0.76,100.84 149.48,100.84 149.48,0.51 0.76,0.51
M1A1
  Top 0.152: IC2.2 33.2,51.47
  Top 0.762: IC2.1 33.18,52.07 30,55.24 26.67,55.24 J3.5
  Top 0.813: IC2.1 33.2,51.47
M1B1
  Top 0.152: 33.2,48.92 IC2.6 33.2,49.19 33.18,49.21 33.2,49.24 IC2.5 33.2,48.92
  Top 0.762: 33.18,49.21 29.21,49.21 J3.4
  Top 0.813: 32.26,49.21 32.55,48.92 33.2,48.92
M2A1
  Top 0.152: IC2.11 33.2,44.79
  Top 0.762: IC2.12 33.18,44.77 32.81,44.4 29.69,41.27 26.67,41.27 J3.1
  Top 0.813: 33.2,44.79 32.81,44.4 32.68,44.54 32.68,45.3 33.2,45.3 33.2,44.79
M2B1
  Top 0.152: IC2.8 33.2,47.74 33.04,47.9 IC2.7
  Top 0.813: 32.33,47.57 32.72,47.57 33.04,47.9 | J3.2 29.51,44.76 32.33,47.57 | 33.04,47.9 33.04,47.57 | 32.33,47.57 32.65,47.9 33.04,47.9
M3A1  (via drill 0.35)
  Top 0.152: IC4.2 IC4.1
  Top 0.813: v83.06,36.96 81.11,36.96 IC4.1 80.84,37.17
  Bottom 0.813: J4.1 102.03,46.34 94.17,38.48 84.71,38.48 83.31,37.08 83.19,37.08 v83.06,36.96
M3B1  (via drill 0.35)
  Top 0.152: IC4.6 IC4.5
  Top 0.254: IC4.5 81.05,39.5
  Top 0.813: v82.8,39.5 81.05,39.5 81,39.45 81,39.73
  Bottom 0.813: J4.2 92.78,39.5 v82.8,39.5
M4A1  (via drill 0.35)
  Top 0.152: IC4.11 80.84,43.35
  Top 0.762: 80.96,43.81 IC4.12
  Top 0.813: IC4.12 80.84,43.35 81.06,43.56 v82.68,43.56
  Bottom 0.813: J4.5 96.37,53.59 96.37,47.7 92.23,43.56 v82.68,43.56
M4B1  (via drill 0.35)
  Top 0.152: IC4.7 IC4.8 81,41.07
  Top 0.813: v82.68,40.89 81.18,40.89 81,41.07 81,40.75
  Bottom 0.813: J4.4 97.39,51.11 97.39,47.28 91.01,40.89 v82.68,40.89
N$1
  Top 0.508: R7.2 42.07,35.72 39.37,35.72 LED2.C
N$4
  Top 1.651: BATERY.1 33.27,13.55 U$2.IN
N$5
  Top 0.152: 14.71,32.45 14.71,32.5 Q1.3
  Top 1.651: U$2.OUT 26.26,19.37 25.12,20.23 19.6,25.75 19.48,26.53 19.48,27.68 14.71,32.45 14.54,32.45 13.97,33.02 14.14,33.02
PWM0  (via drill 0.3)
  Top 0.254: v69.37,48.42 67.94,48.42 66.52,46.99 60.64,46.99 U1.6
  Bottom 0.254: v69.37,48.42 71.12,48.42 83.66,60.96 JP5.1
PWM1  (via drill 0.3)
  Top 0.254: v79.69,59.85 78.9,59.05 59.69,59.05 59.69,47.94 59.85,47.78 60.48,47.78 U1.7
  Bottom 0.254: v79.69,59.85 83.34,63.5 JP5.2
PWM2  (via drill 0.3)
  Top 0.254: v61.91,47.78 61.44,48.26 60.64,48.26 U1.8 | v72.39,37.31 73.5,37.31 IC4.23
  Bottom 0.254: v72.39,37.31 v61.91,47.78
PWM3  (via drill 0.3)
  Top 0.254: v63.34,47.78 62.23,48.9 60.64,48.9 U1.9 | v72.23,38.89 72.23,38.1 73.5,38.1 IC4.22
  Bottom 0.254: v72.23,38.89 v63.34,47.78
PWM4  (via drill 0.3)
  Top 0.254: v71.75,45.72 71.6,45.72 71.6,47.31 69.37,49.53 60.64,49.53 U1.10 | v76.68,40.8 74.45,38.58 73.66,38.58 IC4.21
  Bottom 0.254: v76.68,40.8 v71.75,45.72
PWM5  (via drill 0.3)
  Top 0.254: v63.82,50.32 60.64,50.32 U1.11 | v71.28,42.86 72.87,41.27 73.5,41.27 IC4.17
  Bottom 0.254: v71.28,42.86 v63.82,50.32
PWM6  (via drill 0.3)
  Top 0.254: v73.34,48.58 70.8,51.12 63.5,51.12 63.34,50.96 60.64,50.96 U1.12 | v75.72,46.2 75.72,42.07 74.45,42.07 74.3,41.91 73.66,41.91 IC4.16
  Bottom 0.254: v75.72,46.2 v73.34,48.58
PWM7
  Top 0.254: U1.13 60.64,51.59 71.44,51.59 74.93,48.1 74.93,42.55 73.66,42.55 IC4.15
PWM8
  Top 0.254: U1.15 54.61,52.23 54.45,52.07 41.91,52.07 41.12,51.28 40.48,51.28 IC2.23
PWM9
  Top 0.254: U1.16 54.61,51.59 54.45,51.44 42.07,51.44 41.27,50.64 40.48,50.64 IC2.22
PWM10
  Top 0.254: U1.17 54.61,50.96 42.39,50.96 41.43,50.01 40.48,50.01 IC2.21
PWM11  (via drill 0.3)
  Top 0.254: v43.66,49.69 44.45,50.48 49.05,50.48 49.21,50.32 54.61,50.32 U1.18 | v41.75,47.78 41.43,47.47 40.48,47.47 IC2.17
  Bottom 0.254: v41.75,47.78 v43.66,49.69
PWM12
  Top 0.254: U1.19 54.77,49.69 55.4,49.69 55.72,50.01 55.85,54.26 38.61,54.26 38.61,46.83 40.32,46.83 IC2.16
PWM13  (via drill 0.3)
  Top 0.254: v47.97,49.59 49.02,49.15 49.78,49.15 54.61,48.9 U1.20 | v46.51,47.47 45.72,46.67 41.75,46.67 41.27,46.2 40.48,46.2 IC2.15
  Bottom 0.254: v47.97,49.59 47.05,48.23 v46.51,47.47
PWM14  (via drill 0.3)
  Top 0.254: v58.42,59.85 58.42,51.44 55.4,48.42 54.77,48.42 U1.21 | v60.33,61.75 64.61,66.04 JP5.3
  Bottom 0.254: v60.33,61.75 v58.42,59.85
PWM15  (via drill 0.3)
  Top 0.254: v75.25,59.85 59.21,59.85 59.21,51.44 55.56,47.78 54.77,47.78 U1.22
  Bottom 0.254: v75.25,59.85 83.82,68.42 JP5.4
RESET  (via drill 0.3)
  Top 0.508: B1.RESET JP6.6 | SW2.B' 24.92,59.37 31.59,59.37 SW2.B 31.91,59.21 37.81,59.21 v37.81,49.5
  Bottom 0.508: v37.81,49.5 55.88,31.43 JP6.6
SCL  (via drill 0.3)
  Top 0.508: R22.1 39.21,71.12 40.64,72.55 41.59,72.55 JP7.1 | v59.37,46.51 58.9,46.51 57.47,45.09 54.77,45.09 U1.26 | COLORSENSOR2.4 10.32,48.1 19.53,48.1 25.08,42.55 25.08,34.61 v62.71,34.61 | 126.84,77.15 120.49,77.15 118.43,79.22 111.92,79.22 109.22,76.52 B1.21 | 126.84,77.15 132.24,77.15 X2.5 | 126.84,77.15 v126.84,61.12 | v91.76,15.88 69.53,15.88 67.36,13.7 54.65,13.7 53.53,12.59 X3.5 | 124.94,21.27 95.41,21.27 93.34,19.21 v93.19,19.21 | 124.94,21.27 130.97,21.27 132.24,22.54 X1.5 | 124.94,21.27 v124.94,56.67 | B1.A5 86.36,29.37 81.28,34.45 JP8.1
  Bottom 0.508: 68.26,40.16 72.07,36.35 79.38,36.35 81.28,34.45 JP8.1 | 68.26,40.16 61.91,46.51 v59.37,46.51 41.75,64.14 41.75,72.55 JP7.1 | 68.26,40.16 v62.71,34.61 | v126.84,61.12 128.11,59.85 | 128.11,59.85 IMU2.1 | 92.87,18.89 86.68,25.08 86.68,27.62 B1.A5 | 92.87,18.89 93.82,17.94 | 93.82,17.94 99.54,12.22 X4.5 | 93.82,17.94 v91.76,15.88 | v93.19,19.21 92.87,18.89 | v124.94,56.67 128.11,59.85
SDA  (via drill 0.3, 0.35)
  Top 0.305: v56.13,44.07 55.82,44.07 55.44,44.45 55.42,44.43 U1.27
  Top 0.508: B1.A4 83.82,30.8 81.76,32.86 80.33,32.86 78.74,34.45 JP8.2 | 83.03,10.95 97.31,10.95 98.58,9.68 X4.6 | 83.03,10.95 67.79,10.95 67.47,11.27 53.29,11.27 X3.6 | 83.03,10.95 v83.03,13.02 | JP7.2 44.13,72.55 43.97,72.55 43.97,70.64 R21.1 43.66,70.48 43.66,68.74 v37.47,62.55 | COLORSENSOR2.5 10.95,51.59 24.29,51.59 26.35,53.66 28.57,53.66 v29.21,54.29 | 128.11,55.88 128.11,35.56 135.89,27.78 136.05,27.78 136.05,22.7 134.94,21.59 X1.6 134.62,21.59 132.4,19.37 114.78,19.37 v114.3,18.89 | IMU2.2 128.11,55.88 | X2.6 134.78,76.2 134.78,73.5 127.79,66.52 127.79,56.04 127.95,56.04 128.11,55.88 | 110.33,79.85 110.49,80.01 127.32,80.01 129.22,78.11 v129.38,78.11 | 110.33,79.85 B1.20 | v44.29,80.17 44.45,80.01 110.17,80.01 110.33,79.85
  Bottom 0.508: B1.A4 83.82,18.89 83.03,18.1 v83.03,13.02 | v29.21,54.29 v37.47,62.55 | v129.38,78.11 131.76,75.72 134.46,75.72 134.94,76.2 X2.6 | v44.29,80.17 44.29,72.71 JP7.2 | v114.3,18.89 103.5,8.1 100.17,8.1 98.74,9.53 X4.6 | 37.66,62.55 v37.47,62.55 | v37.47,62.55 55.94,44.07 v56.13,44.07
SERVO5V  (via drill 0.3)
  Top 0.762: 28.26,67.47 32.23,71.44 32.23,73.03 SERVO4.2 32.23,73.34 32.23,75.56 SERVO3.2 | 27.94,67.15 v27.94,61.75 | v17.46,40.64 10.95,34.13 3.65,34.13 3.17,33.66 3.17,19.21 10.32,19.21 IC1.TAB
  Top 0.813: C1.1 28.42,67.31 28.26,67.47 27.94,67.15
  Bottom 0.762: v27.94,61.75 27.94,60.8 22.07,54.93 22.07,45.24 v17.46,40.64

### Text on the board
tPlace: + | - | IR3 | + | - | - | Servo 1 | Servo 1 | Opt | Opt | Servo | Servo | Gnd | + | Servo 2 | Servo 2 | Servo pins | Servo pins | S1 | S1 | S2 | S2 | PWMs | PWMs | #15 | #15 | + | - | Reset | Reset | #14 | #14 | #1 | #1 | #0 | #0 | vin | M1 | M1 | GND | GND | M4 | M2 | M2 | - | + | - | + | VIN | VIN | GND | Jumper | Jumper | Power | Power | logic: | logic: | 3v | 3v | 5v | 5v | 4 | 4 | 5 | 5 | M3 | M3 | + | + | - | - | 5-12V Motor | 5-12V Motor | Power | Power | + | - | + | - | IR6
tNames: GND | GND | VIN | VIN | SIGNAL | Pins 8-13 are dedicated to IR / A15=IR1 / A14=IR2 / A13=IR3 | SIGNAL | SIGNAL | VIN | A12=IR4 / A11=IR5 / A10=IR6 / A6=IR7 / A7=IR8 | ESC Connections: / D2=ESC1 / D3=ESC2 / D4=ESC3 / D5=ESC4 / D6=ESC5 / D7=ESC6 | GND | SCL | GND | SDA | SIGNAL | GND | SIGNAL | VIN | SDA | SCL | 3v3 | GND | VIN | GND | 3v3 | VIN | ___ 3v3 | GND | VIN | SIGNAL | Designed By, / David Bershadsky